# EAGLE design BeeLogic (EAGLE 9.2.1)

## Sheet 1 of 7: uC
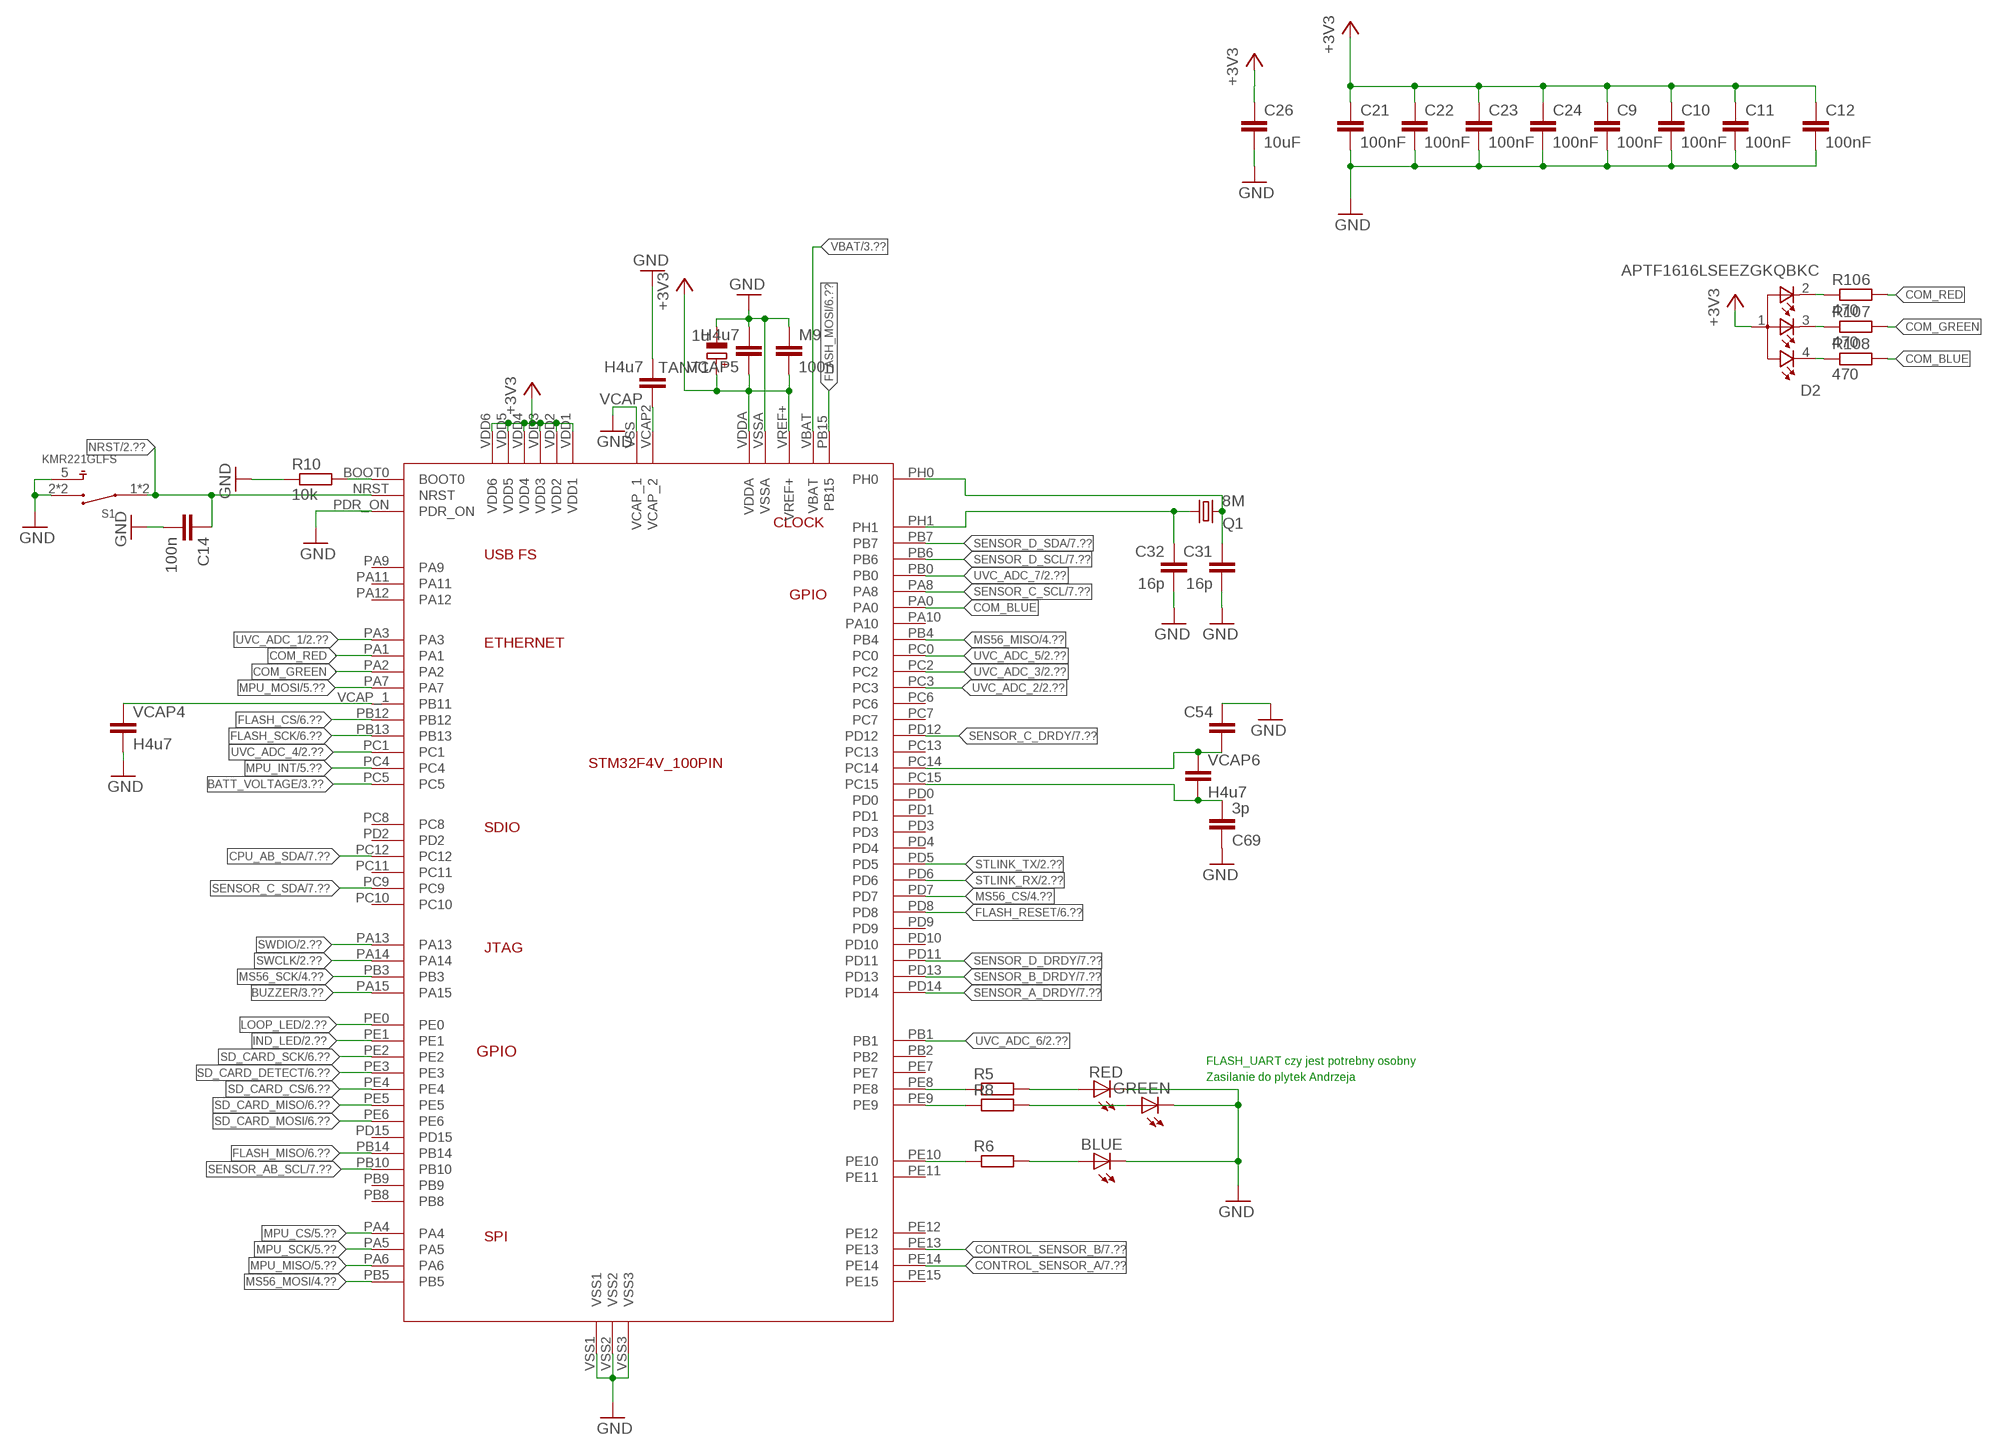
[diagram p0: schematic, sheet 1]

### Parts
BLUE  LEDCHIPLED_0603  [CHIPLED_0603]
C9  100nF  C-EUC0603K  [C0603K]
C10  100nF  C-EUC0603K  [C0603K]
C11  100nF  C-EUC0603K  [C0603K]
C12  100nF  C-EUC0603K  [C0603K]
C14  100n  C-EUC0603K  [C0603K]
C21  100nF  C-EUC0603K  [C0603K]
C22  100nF  C-EUC0603K  [C0603K]
C23  100nF  C-EUC0603K  [C0603K]
C24  100nF  C-EUC0603K  [C0603K]
C26  10uF  C-EUC0805K  [C0805K]
C31  16p  C-EUC0603K  [C0603K]
C32  16p  C-EUC0603K  [C0603K]
C54  3p  C-EUC0603K  [C0603K]
C69  3p  C-EUC0603K  [C0603K]
D2  APTF1616LSEEZGKQBKC  [LEDSC160X160X070-4N]
GREEN  LEDCHIPLED_0603  [CHIPLED_0603]
M9  100n  C-EUC0603K  [C0603K]
Q1  8M  CRYSTALCTS406  [CTS406]
R5  R-EU_R0603  [R0603]
R6  R-EU_R0603  [R0603]
R8  R-EU_R0603  [R0603]
R10  10k  R-EU_R0603  [R0603]
R106  470  R-EU_R0603  [R0603]
R107  470  R-EU_R0603  [R0603]
R108  470  R-EU_R0603  [R0603]
RED  LEDCHIPLED_0603  [CHIPLED_0603]
S1  KMR221GLFS  [SW_KMR221GLFS]
STM32F446VET1  STM32F4V_100PIN_GPSBOARD  [LQFP100]
TANT1  1u  CPOL-EUSMCA  [SMC_A]
VCAP  H4u7  C-EUC0805K  [C0805K]
VCAP4  H4u7  C-EUC0805K  [C0805K]
VCAP5  H4u7  C-EUC0805K  [C0805K]
VCAP6  H4u7  C-EUC0805K  [C0805K]

### Nets
+3V3: C9.1 C10.1 C11.1 C12.1 C21.1 C22.1 C23.1 C24.1 C26.1 D2.1 M9.2 STM32F446VET1.VDD1 STM32F446VET1.VDD2 STM32F446VET1.VDD3 STM32F446VET1.VDD4 STM32F446VET1.VDD5 STM32F446VET1.VDD6 STM32F446VET1.VDDA STM32F446VET1.VREF+ TANT1.+ VCAP5.1 ; also sheet 2,3,4,5,6,7
BATT_VOLTAGE: STM32F446VET1.PC5 ; also sheet 3
BUZZER: STM32F446VET1.PA15 ; also sheet 3
COM_BLUE: R108.2 STM32F446VET1.PA0
COM_GREEN: R107.2 STM32F446VET1.PA2
COM_RED: R106.2 STM32F446VET1.PA1
CONTROL_SENSOR_A: STM32F446VET1.PE14 ; also sheet 7
CONTROL_SENSOR_B: STM32F446VET1.PE13 ; also sheet 7
CPU_AB_SDA: STM32F446VET1.PC12 ; also sheet 7
FLASH_CS: STM32F446VET1.PB12 ; also sheet 6
FLASH_MISO: STM32F446VET1.PB14 ; also sheet 6
FLASH_MOSI: STM32F446VET1.PB15 ; also sheet 6
FLASH_RESET: STM32F446VET1.PD8 ; also sheet 6
FLASH_SCK: STM32F446VET1.PB13 ; also sheet 6
GND: BLUE.C C9.2 C10.2 C11.2 C12.2 C14.2 C21.2 C22.2 C23.2 C24.2 C26.2 C31.2 C32.2 C54.2 C69.1 GREEN.C M9.1 R10.1 RED.C S1.2 S1.3 S1.5 STM32F446VET1.PDR_ON STM32F446VET1.VSS1 STM32F446VET1.VSS2 STM32F446VET1.VSS3 STM32F446VET1.VSS(VCAP_1) STM32F446VET1.VSSA TANT1.- VCAP4.2 VCAP5.2 VCAP.2 ; also sheet 2,3,4,5,6,7
IND_LED: STM32F446VET1.PE1 ; also sheet 2
LOOP_LED: STM32F446VET1.PE0 ; also sheet 2
MPU_CS: STM32F446VET1.PA4 ; also sheet 5
MPU_INT: STM32F446VET1.PC4 ; also sheet 5
MPU_MISO: STM32F446VET1.PA6 ; also sheet 5
MPU_MOSI: STM32F446VET1.PA7 ; also sheet 5
MPU_SCK: STM32F446VET1.PA5 ; also sheet 5
MS56_CS: STM32F446VET1.PD7 ; also sheet 4
MS56_MISO: STM32F446VET1.PB4 ; also sheet 4
MS56_MOSI: STM32F446VET1.PB5 ; also sheet 4
MS56_SCK: STM32F446VET1.PB3 ; also sheet 4
N$6: R5.1 STM32F446VET1.PE8
N$7: R8.1 STM32F446VET1.PE9
N$10: R6.1 STM32F446VET1.PE10
N$11: R10.2 STM32F446VET1.BOOT0
N$12: C31.1 Q1.3 STM32F446VET1.PH0
N$13: C32.1 Q1.1 STM32F446VET1.PH1
N$14: R5.2 RED.A
N$15: GREEN.A R8.2
N$16: BLUE.A R6.2
N$20: STM32F446VET1.VCAP2(VCAP_2) VCAP.1
N$70: STM32F446VET1.VCAP_1(PB11) VCAP4.1
N$102: D2.2 R106.1
N$103: D2.3 R107.1
N$104: D2.4 R108.1
N$108: C54.1 STM32F446VET1.PC14 VCAP6.1
N$109: C69.2 STM32F446VET1.PC15 VCAP6.2
NRST: C14.1 S1.1 S1.4 STM32F446VET1.NRST ; also sheet 2
SD_CARD_CS: STM32F446VET1.PE4 ; also sheet 6
SD_CARD_DETECT: STM32F446VET1.PE3 ; also sheet 6
SD_CARD_MISO: STM32F446VET1.PE5 ; also sheet 6
SD_CARD_MOSI: STM32F446VET1.PE6 ; also sheet 6
SD_CARD_SCK: STM32F446VET1.PE2 ; also sheet 6
SENSOR_A_DRDY: STM32F446VET1.PD14 ; also sheet 7
SENSOR_AB_SCL: STM32F446VET1.PB10 ; also sheet 7
SENSOR_B_DRDY: STM32F446VET1.PD13 ; also sheet 7
SENSOR_C_DRDY: STM32F446VET1.PD12 ; also sheet 7
SENSOR_C_SCL: STM32F446VET1.PA8 ; also sheet 7
SENSOR_C_SDA: STM32F446VET1.PC9 ; also sheet 7
SENSOR_D_DRDY: STM32F446VET1.PD11 ; also sheet 7
SENSOR_D_SCL: STM32F446VET1.PB6 ; also sheet 7
SENSOR_D_SDA: STM32F446VET1.PB7 ; also sheet 7
STLINK_RX: STM32F446VET1.PD6 ; also sheet 2
STLINK_TX: STM32F446VET1.PD5 ; also sheet 2
SWCLK: STM32F446VET1.PA14 ; also sheet 2
SWDIO: STM32F446VET1.PA13 ; also sheet 2
UVC_ADC_1: STM32F446VET1.PA3 ; also sheet 2
UVC_ADC_2: STM32F446VET1.PC3 ; also sheet 2
UVC_ADC_3: STM32F446VET1.PC2 ; also sheet 2
UVC_ADC_4: STM32F446VET1.PC1 ; also sheet 2
UVC_ADC_5: STM32F446VET1.PC0 ; also sheet 2
UVC_ADC_6: STM32F446VET1.PB1 ; also sheet 2
UVC_ADC_7: STM32F446VET1.PB0 ; also sheet 2
VBAT: STM32F446VET1.VBAT ; also sheet 3
Unconnected: STM32F446VET1.PA9 STM32F446VET1.PA10 STM32F446VET1.PA11 STM32F446VET1.PA12 STM32F446VET1.PB2 STM32F446VET1.PB8 STM32F446VET1.PB9 STM32F446VET1.PC6 STM32F446VET1.PC7 STM32F446VET1.PC8 STM32F446VET1.PC10 STM32F446VET1.PC11 STM32F446VET1.PC13 STM32F446VET1.PD0 STM32F446VET1.PD1 STM32F446VET1.PD2 STM32F446VET1.PD3 STM32F446VET1.PD4 STM32F446VET1.PD9 STM32F446VET1.PD10 STM32F446VET1.PD15 STM32F446VET1.PE7 STM32F446VET1.PE11 STM32F446VET1.PE12 STM32F446VET1.PE15

### Notes on the sheet
- FLASH_UART czy jest potrebny osobny
- Zasilanie do plytek Andrzeja

## Sheet 2 of 7: PLUGS
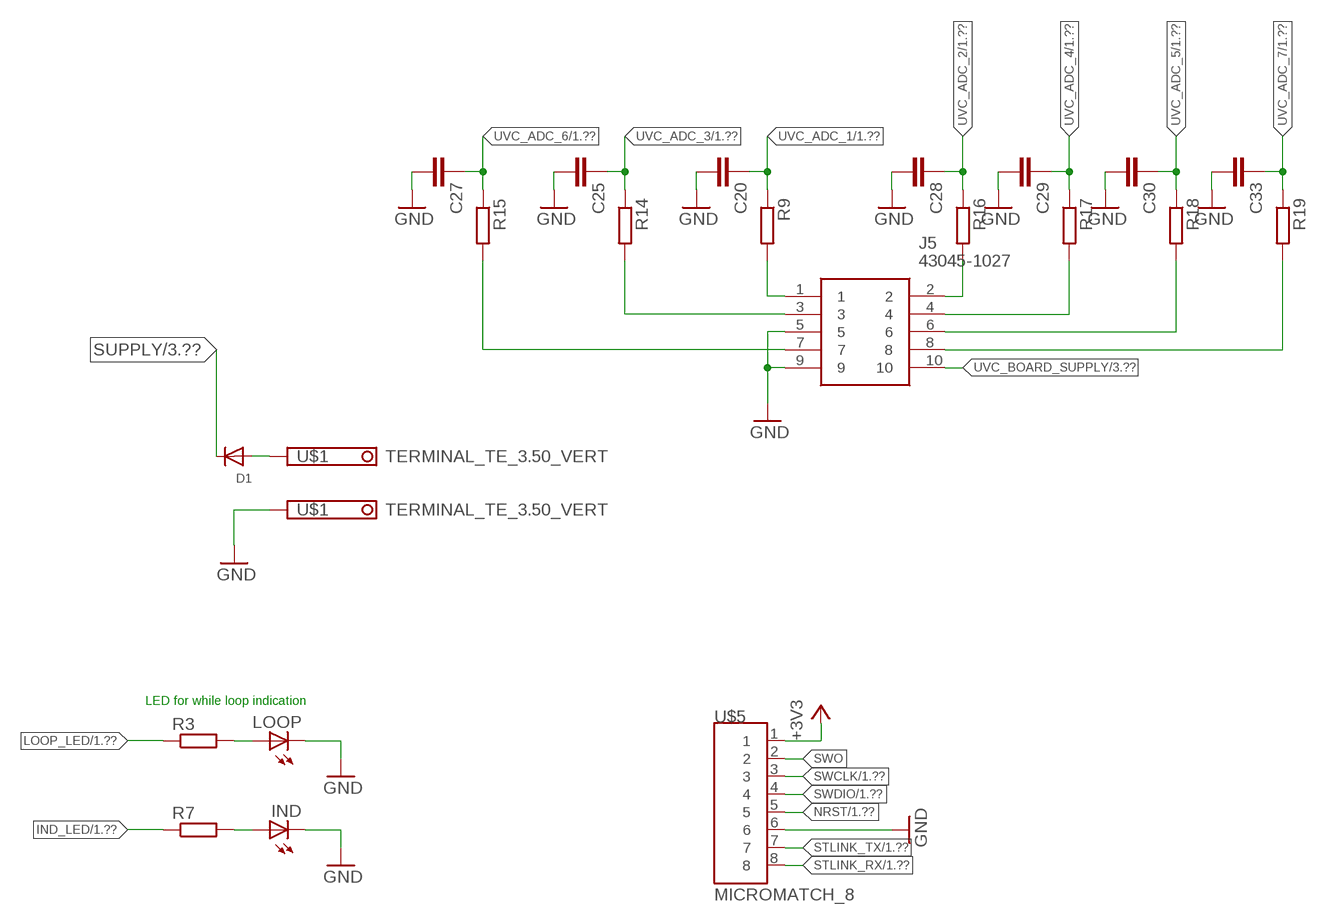
[diagram p1: schematic, sheet 2]

### Parts
C20  C-EUC0603  [C0603]
C25  C-EUC0603  [C0603]
C27  C-EUC0603  [C0603]
C28  C-EUC0603  [C0603]
C29  C-EUC0603  [C0603]
C30  C-EUC0603  [C0603]
C33  C-EUC0603  [C0603]
D1  DIODE_SOD-123FL  [SOD-123FL]
IND  LEDCHIPLED_0603  [CHIPLED_0603]
J5  43045-1027  [43045-1028_1]
LOOP  LEDCHIPLED_0603  [CHIPLED_0603]
R3  R-EU_R0603  [R0603]
R7  R-EU_R0603  [R0603]
R9  R-EU_R0603  [R0603]
R14  R-EU_R0603  [R0603]
R15  R-EU_R0603  [R0603]
R16  R-EU_R0603  [R0603]
R17  R-EU_R0603  [R0603]
R18  R-EU_R0603  [R0603]
R19  R-EU_R0603  [R0603]
U$1  TERMINAL_TE_3.50_VERT  [TE_3.5_TERMINAL_VERT]
U$5  MICROMATCH_8  [MICROMATCH_8]

### Nets
+3V3: U$5.1 ; also sheet 1,3,4,5,6,7
GND: C20.2 C25.2 C27.2 C28.2 C29.2 C30.2 C33.2 IND.C J5.5 J5.9 LOOP.C U$1.P$2(K1) U$5.6 ; also sheet 1,3,4,5,6,7
IND_LED: R7.1 ; also sheet 1
LOOP_LED: R3.1 ; also sheet 1
N$2: LOOP.A R3.2
N$4: D1.A U$1.P$1(K)
N$8: IND.A R7.2
N$17: J5.1 R9.2
N$18: J5.7 R15.2
N$19: J5.3 R14.2
N$25: J5.2 R16.2
N$27: J5.4 R17.2
N$29: J5.6 R18.2
N$34: J5.8 R19.2
NRST: U$5.5 ; also sheet 1
STLINK_RX: U$5.8 ; also sheet 1
STLINK_TX: U$5.7 ; also sheet 1
SUPPLY: D1.C ; also sheet 3
SWCLK: U$5.3 ; also sheet 1
SWDIO: U$5.4 ; also sheet 1
SWO: U$5.2
UVC_ADC_1: C20.1 R9.1 ; also sheet 1
UVC_ADC_2: C28.1 R16.1 ; also sheet 1
UVC_ADC_3: C25.1 R14.1 ; also sheet 1
UVC_ADC_4: C29.1 R17.1 ; also sheet 1
UVC_ADC_5: C30.1 R18.1 ; also sheet 1
UVC_ADC_6: C27.1 R15.1 ; also sheet 1
UVC_ADC_7: C33.1 R19.1 ; also sheet 1
UVC_BOARD_SUPPLY: J5.10 ; also sheet 3

### Notes on the sheet
- LED for while loop indication

## Sheet 3 of 7: SUPPLY
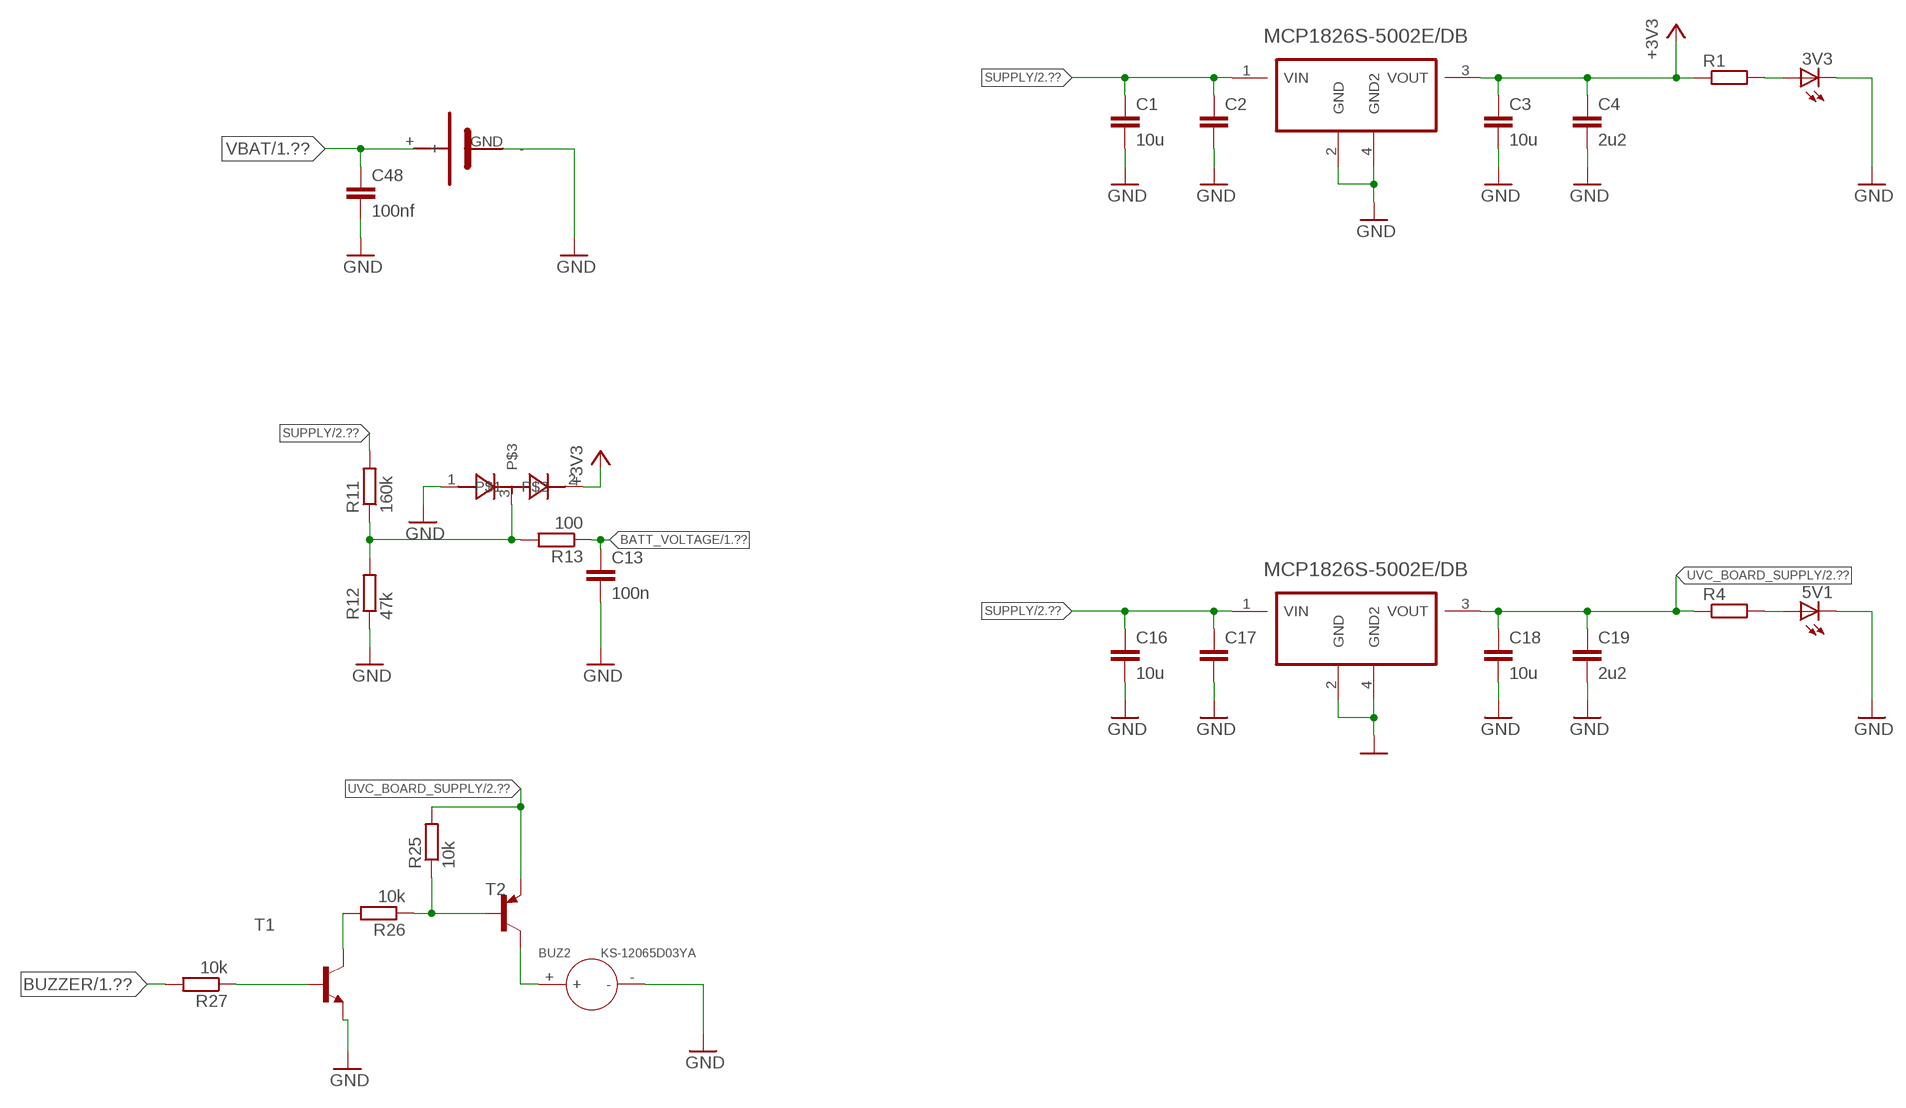
[diagram p2: schematic, sheet 3]

### Parts
3V3  LEDCHIPLED_0603  [CHIPLED_0603]
5V1  LEDCHIPLED_0603  [CHIPLED_0603]
BUZ2  KS-12065D03YA  DIP-BUZZER-3V(KS-12065D03YA)  [BZ2-7.6-D12.0XH6.5MM]
C1  10u  C-EUC0805K  [C0805K]
C2  C-EUC0805K  [C0805K]
C3  10u  C-EUC0805K  [C0805K]
C4  2u2  C-EUC0805K  [C0805K]
C13  100n  C-EUC0603  [C0603]
C16  10u  C-EUC0805K  [C0805K]
C17  C-EUC0805K  [C0805K]
C18  10u  C-EUC0805K  [C0805K]
C19  2u2  C-EUC0805K  [C0805K]
C48  100nf  C-EUC0805K  [C0805K]
R1  R-EU_R0603  [R0603]
R4  R-EU_R0603  [R0603]
R11  160k  R-EU_R0603  [R0603]
R12  47k  R-EU_R0603  [R0603]
R13  100  R-EU_R0603  [R0603]
R25  10k  R-EU_R0603  [R0603]
R26  10k  R-EU_R0603  [R0603]
R27  10k  R-EU_R0603  [R0603]
T1  BCW81-NPN-SOT23-BEC  [SOT23-BEC]
T2  BC807-16-PNP-SOT23-BEC  [SOT23-BEC]
U1  MCP1826S-5002E/DB  [SOT230P700X180-4N]
U3  MCP1826S-5002E/DB  [SOT230P700X180-4N]
U$16  BAS40W-04  [SOT65P210X110-3N]
U$32  CR1220_POZ  [CR1220_POZ]

### Nets
+3V3: C3.1 C4.1 R1.1 U1.3(VOUT) U$16.2 ; also sheet 1,2,4,5,6,7
BATT_VOLTAGE: C13.1 R13.1 ; also sheet 1
BUZZER: R27.2 ; also sheet 1
GND: 3V3.C 5V1.C BUZ2.- C1.2 C2.2 C3.2 C4.2 C13.2 C16.2 C17.2 C18.2 C19.2 C48.2 R12.1 T1.E U1.2(GND) U1.4(GND2) U3.2(GND) U3.4(GND2) U$16.1 U$32.GND(-) ; also sheet 1,2,4,5,6,7
N$1: 3V3.A R1.2
N$5: 5V1.A R4.2
N$9: R11.1 R12.2 R13.2 U$16.3
N$24: R25.1 R26.1 T2.B
N$31: BUZ2.+ T2.C
N$32: R26.2 T1.C
N$33: R27.1 T1.B
SUPPLY: C1.1 C2.1 C16.1 C17.1 R11.2 U1.1(VIN) U3.1(VIN) ; also sheet 2
UVC_BOARD_SUPPLY: C18.1 C19.1 R4.1 R25.2 T2.E U3.3(VOUT) ; also sheet 2
VBAT: C48.1 U$32.+ ; also sheet 1

## Sheet 4 of 7: MS5607
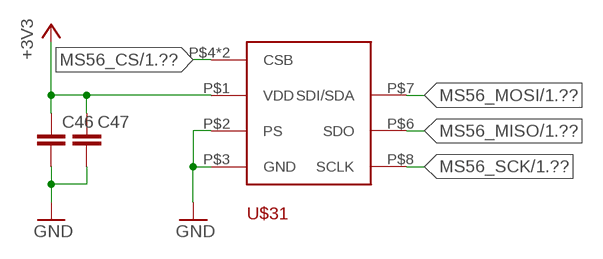
[diagram p3: schematic, sheet 4]

### Parts
C46  C-EUC0603  [C0603]
C47  C-EUC0603  [C0603]
U$31  MS56XX  [MS56XX]

### Nets
+3V3: C46.1 C47.1 U$31.P$1(VDD) ; also sheet 1,2,3,5,6,7
GND: C46.2 C47.2 U$31.P$2(PS) U$31.P$3(GND) ; also sheet 1,2,3,5,6,7
MS56_CS: U$31.P$4(CSB) U$31.P$5(CSB) ; also sheet 1
MS56_MISO: U$31.P$6(SDO) ; also sheet 1
MS56_MOSI: U$31.P$7(SDI/SDA) ; also sheet 1
MS56_SCK: U$31.P$8(SCLK) ; also sheet 1

## Sheet 5 of 7: MPU9250
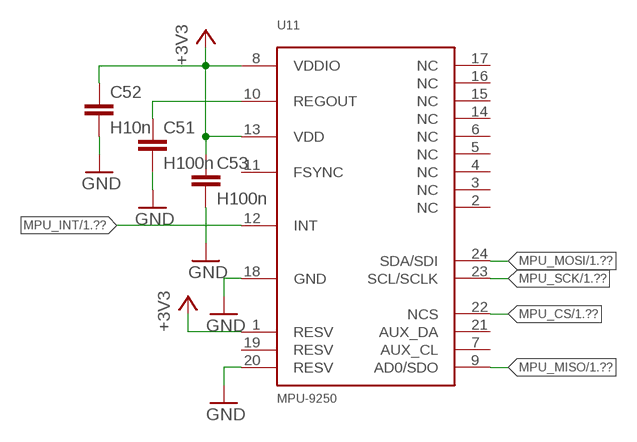
[diagram p4: schematic, sheet 5]

### Parts
C51  H100n  C-EUC0603K  [C0603K]
C52  H10n  C-EUC0603K  [C0603K]
C53  H100n  C-EUC0603K  [C0603K]
U11  MPU-9250  [MPU-9250]

### Nets
+3V3: C52.1 C53.1 U11.1(RESV) U11.8(VDDIO) U11.13(VDD) ; also sheet 1,2,3,4,6,7
GND: C51.2 C52.2 C53.2 U11.18(GND) U11.20(RESV) ; also sheet 1,2,3,4,6,7
MPU_CS: U11.22(NCS) ; also sheet 1
MPU_INT: U11.12(INT) ; also sheet 1
MPU_MISO: U11.9(AD0/SDO) ; also sheet 1
MPU_MOSI: U11.24(SDA/SDI) ; also sheet 1
MPU_SCK: U11.23(SCL/SCLK) ; also sheet 1
N$35: C51.1 U11.10(REGOUT)
Unconnected: U11.2(NC) U11.3(NC) U11.4(NC) U11.5(NC) U11.6(NC) U11.7(AUX_CL) U11.11(FSYNC) U11.14(NC) U11.15(NC) U11.16(NC) U11.17(NC) U11.19(RESV) U11.21(AUX_DA)

## Sheet 6 of 7: SAVE DATA
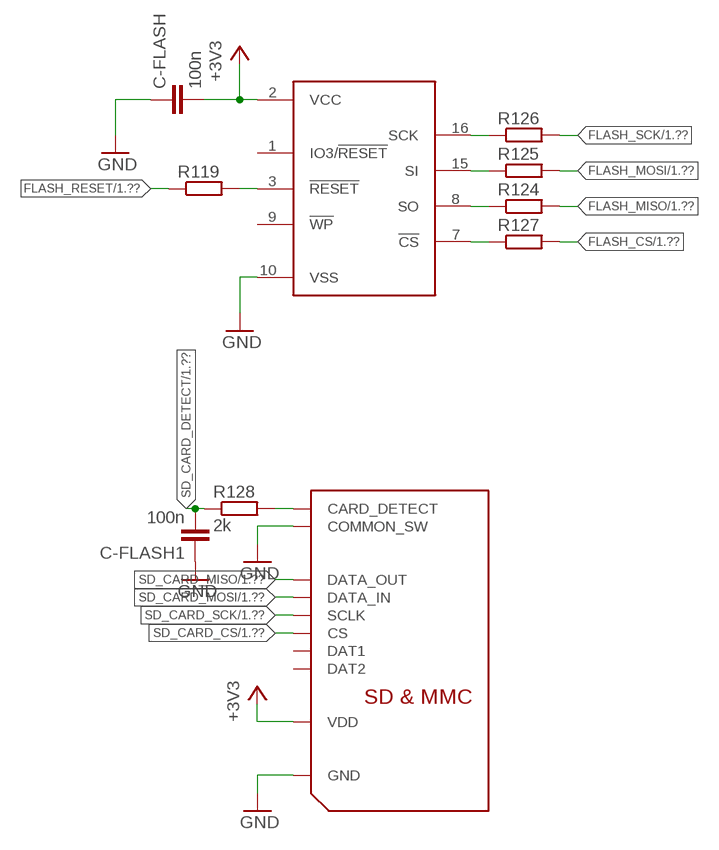
[diagram p5: schematic, sheet 6]

### Parts
C-FLASH  100n  C-EUC0603K  [C0603K]
C-FLASH1  100n  C-EUC0603K  [C0603K]
R119  R-EU_R0603  [R0603]
R124  R-EU_R0603  [R0603]
R125  R-EU_R0603  [R0603]
R126  R-EU_R0603  [R0603]
R127  R-EU_R0603  [R0603]
R128  2k  R-EU_R0603  [R0603]
U$2  S25FLX  [SOIC16]
U$4  MOLEX_MICRO_SD_503182-1853  [MOLEX_MICRO_SD_503182-1853]

### Nets
+3V3: C-FLASH.2 U$2.2(VCC) U$4.PIN4(VDD) ; also sheet 1,2,3,4,5,7
FLASH_CS: R127.2 ; also sheet 1
FLASH_MISO: R124.2 ; also sheet 1
FLASH_MOSI: R125.2 ; also sheet 1
FLASH_RESET: R119.1 ; also sheet 1
FLASH_SCK: R126.2 ; also sheet 1
GND: C-FLASH1.1 C-FLASH.1 U$2.10(VSS) U$4.DETECT_GND(COMMON_SW) U$4.PIN6(GND) ; also sheet 1,2,3,4,5,7
N$161: R126.1 U$2.16(SCK)
N$162: R125.1 U$2.15(SI)
N$163: R124.1 U$2.8(SO)
N$164: R127.1 U$2.7(!CS)
N$165: R119.2 U$2.3(!RESET)
N$166: R128.2 U$4.DETECT(CARD_DETECT)
SD_CARD_CS: U$4.PIN2(CS) ; also sheet 1
SD_CARD_DETECT: C-FLASH1.2 R128.1 ; also sheet 1
SD_CARD_MISO: U$4.PIN7(DATA_OUT) ; also sheet 1
SD_CARD_MOSI: U$4.PIN3(DATA_IN) ; also sheet 1
SD_CARD_SCK: U$4.PIN5(SCLK) ; also sheet 1
Unconnected: U$2.1(IO3/!RESET) U$2.9(!WP) U$4.PIN1(DAT2) U$4.PIN8(DAT1)

## Sheet 7 of 7: Sensors
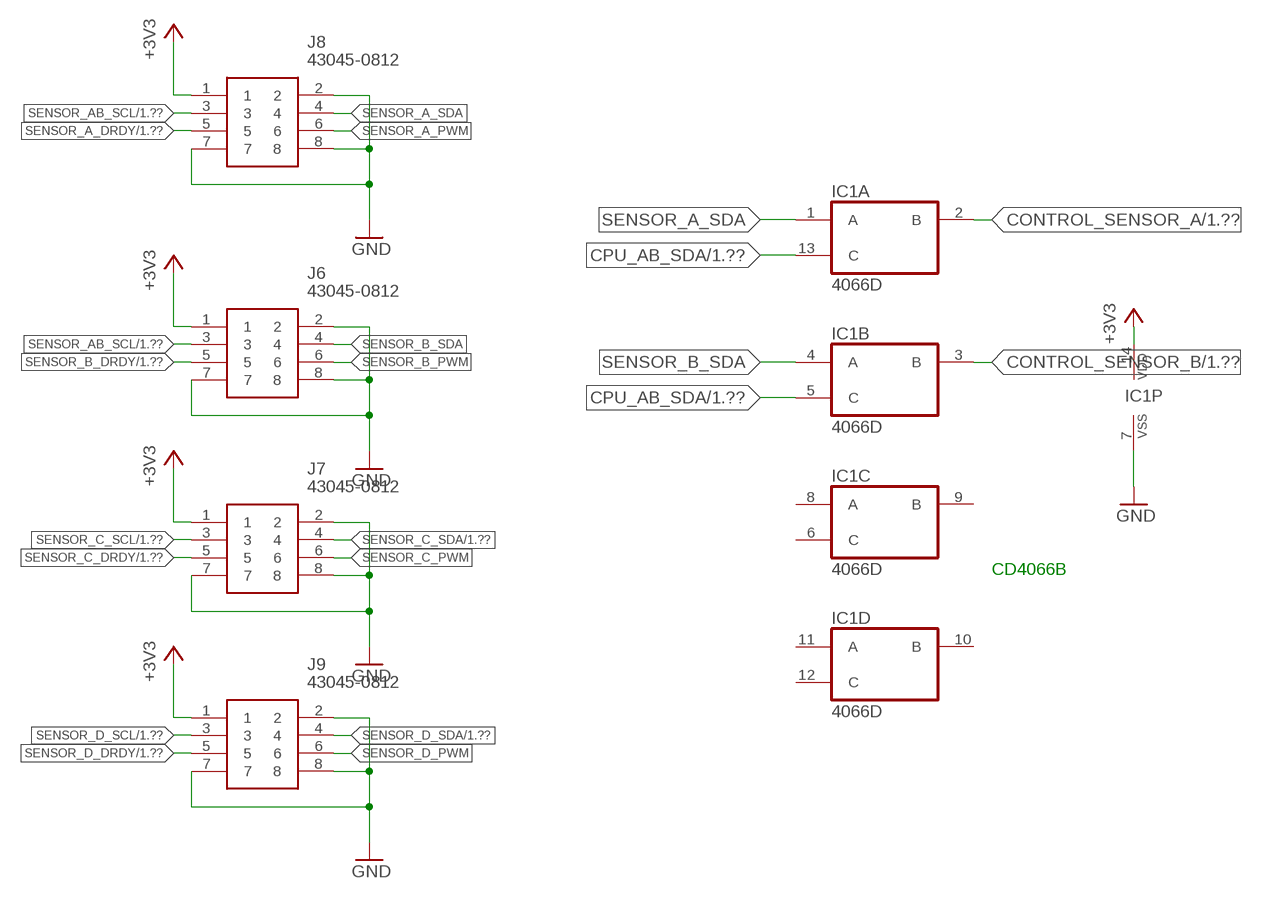
[diagram p6: schematic, sheet 7]

### Parts
IC1  4066D  [SO14]
J6  43045-0812  [430450812]
J7  43045-0812  [430450812]
J8  43045-0812  [430450812]
J9  43045-0812  [430450812]

### Nets
+3V3: IC1.14(P:VDD) J6.1 J7.1 J8.1 J9.1 ; also sheet 1,2,3,4,5,6
CONTROL_SENSOR_A: IC1.2(A:B) ; also sheet 1
CONTROL_SENSOR_B: IC1.3(B:B) ; also sheet 1
CPU_AB_SDA: IC1.5(B:C) IC1.13(A:C) ; also sheet 1
GND: IC1.7(P:VSS) J6.2 J6.7 J6.8 J7.2 J7.7 J7.8 J8.2 J8.7 J8.8 J9.2 J9.7 J9.8 ; also sheet 1,2,3,4,5,6
SENSOR_A_DRDY: J8.5 ; also sheet 1
SENSOR_A_PWM: J8.6
SENSOR_A_SDA: IC1.1(A:A) J8.4
SENSOR_AB_SCL: J6.3 J8.3 ; also sheet 1
SENSOR_B_DRDY: J6.5 ; also sheet 1
SENSOR_B_PWM: J6.6
SENSOR_B_SDA: IC1.4(B:A) J6.4
SENSOR_C_DRDY: J7.5 ; also sheet 1
SENSOR_C_PWM: J7.6
SENSOR_C_SCL: J7.3 ; also sheet 1
SENSOR_C_SDA: J7.4 ; also sheet 1
SENSOR_D_DRDY: J9.5 ; also sheet 1
SENSOR_D_PWM: J9.6
SENSOR_D_SCL: J9.3 ; also sheet 1
SENSOR_D_SDA: J9.4 ; also sheet 1
Unconnected: IC1.6(C:C) IC1.8(C:A) IC1.9(C:B) IC1.10(D:B) IC1.11(D:A) IC1.12(D:C)

### Notes on the sheet
- CD4066B

## Library data of the parts
3V3 5V1 BLUE GREEN IND LOOP RED = adafruit:LED: LED OSRAM: - CHIPLED LG R971, LG N971, LY N971, LG Q971, LY Q971, LO R971, LY R971 LH N974, LH R974 LS Q976, LO Q976, LY Q976 LO Q996 - Hyper CHIPLED LW Q18S LB Q993, LB Q99A, LB R99A - SideLED LS A670, LO A670, LY A670, LG A670, LP A670 LB A673, LV A673, LT A673, LW A673 LH A674 LY A675 LS A676, LA A676, LO A676, LY A676, LW A676 LS A679, LY A679, LG A679 - Hyper Micro SIDELED® LS Y876, LA Y876, LO Y876, LY Y876 LT Y87S - SmartLED LW L88C, LW L88S LB L89C, LB L89S, LG L890 LS L89K, LO L89K, LY L89K LS L896, LA L896, LO L896, LY L896 - TOPLED LS T670, LO T670, LY T670, LG T670, LP T670 LSG T670, LSP T670, LSY T670, LOP T670, LYG T670 LG T671, LOG T671, LSG T671 LB T673, LV T673, LT T673, LW T673 LH T674 LS T676, LA T676, LO T676, LY T676, LB T676, LH T676, LSB T676, LW T676 LB T67C, LV T67C, LT T67C, LS T67K, LO T67K, LY T67K, LW E67C LS E67B, LA E67B, LO E67B, LY E67B, LB E67C, LV E67C, LT E67C LW T67C LS T679, LY T679, LG T679 LS T770, LO T770, LY T770, LG T770, LP T770 LB T773, LV T773, LT T773, LW T773 LH T774 LS E675, LA E675, LY E675, LS T675 LS T776, LA T776, LO T776, LY T776, LB T776 LHGB T686 LT T68C, LB T68C - Hyper Mini TOPLED® LB M676 - Mini TOPLED Santana® LG M470 LS M47K, LO M47K, LY M47K Source: http://www.osram.convergy.de/
BUZ2 = Seeed-Connector:DIP-BUZZER-3V(KS-12065D03YA): 312010004; MPN: KS-12065D03YA
C1-C4 C9-C12 C14 C16-C19 C21-C24 C26 C31 C32 C46-C48 C51-C54 C69 C-FLASH C-FLASH1 M9 VCAP VCAP4-VCAP6 = rcl:C-EU: CAPACITOR, European symbol; SPICEPREFIX: C
C13 = rcl:C-EU: CAPACITOR, European symbol
C20 C25 C27-C30 C33 = resistor:C-EU: CAPACITOR, European symbol
D1 = adafruit:DIODE: Diode SMADIODE - SMA Surface Mount Package 20V 1A Schottky Diode Digikey: 641-1014-6-ND DO-1N4148 - Through Hole Small Current Diode SOD-123 20V 1 A (.5mV Vf) Schottky Diode - Digikey: MBRX120TPMSCT-ND SOD-323 10V 570mA (.38mV Vf, 3ns) Schottky Diode - Digikey: ZLLS410CT-ND SOD-523 30V 30mA Schottky Diode (RB751S-40TE61) - Digikey: RB751S-40TE61CT-ND SOT23-R/W - SOT23 Package (R = Solder Paste/Reflow Ovens, W = Hand-Soldering) BAT54Film 40V 300mA - Digikey: 497-7162-1-ND
D2 = KINGBRIGHT1616:APTF1616LSEEZGKQBKC: HELI Colour; 1.6X1.6MM LOW CURRENT RGB SMD LED; AVAILABILITY: Unavailable; DESCRIPTION: LED RGB 621NM 525NM 465NM 0606; MF: Kingbright; MP: APTF1616LSEEZGKQBKC; PACKAGE: 0606 Kingbright; PRICE: 0.47 USD
IC1 = 40xx:4066: Quad bilateral ANALOG SWITCH
J5 = 43045-1027:43045-1027: Molex MICRO-FIT 3.0 Series, Series Number 43045, 3mm Pitch 10 Way 2 Row Straight PCB Header, Solder Termination, 5A Source: Datasheet <https://www.molex.com/pdm_docs/sd/430451027_sd.pdf>; DESCRIPTION: Molex MICRO-FIT 3.0 Series, Series Number 43045, 3mm Pitch 10 Way 2 Row Straight PCB Header, Solder Termination, 5A; HEIGHT: mm; MANUFACTURER_NAME: Molex; MANUFACTURER_PART_NUMBER: 43045-1027; MOUSER_PART_NUMBER: 538-43045-1027; MOUSER_PRICE-STOCK: https://www.mouser.com/Search/Refine.aspx?Keyword=538-43045-1027; RS_PART_NUMBER: 6700469P; RS_PRICE-STOCK: http://uk.rs-online.com/web/p/products/6700469P
J6-J9 = 43045-0812:43045-0812: 8 way 2 row vertical header,3mm pitch Molex MICRO-FIT 3.0 Series, Series Number 43045, 3mm Pitch 8 Way 2 Row Straight PCB Header, Solder Termination, 5A Source: Datasheet <https://componentsearchengine.com/Datasheets/1/43045-0812.pdf>; DESCRIPTION: 8 way 2 row vertical header,3mm pitch Molex MICRO-FIT 3.0 Series, Series Number 43045, 3mm Pitch 8 Way 2 Row Straight PCB Header, Solder Termination, 5A; HEIGHT: mm; MANUFACTURER_NAME: Molex; MANUFACTURER_PART_NUMBER: 43045-0812; MOUSER_PART_NUMBER: 538-43045-0812; MOUSER_PRICE-STOCK: https://www.mouser.com/Search/Refine.aspx?Keyword=538-43045-0812
Q1 = crystal:CRYSTAL: CRYSTAL; OC_FARNELL: unknown; OC_NEWARK: unknown
R1 R3-R8 R10-R13 R25-R27 R106-R108 R119 R124-R128 = rcl:R-EU_: RESISTOR, European symbol; SPICEPREFIX: R
R9 R14-R19 = resistor:R-EU_: RESISTOR, European symbol
S1 = KMR221GLFS:KMR221GLFS: Switch Tactile N.O. SPST Button Gull Wing 0.05A 32VDC 1VA 200000Cycles 2N SMD Automotive T/R; AVAILABILITY: Good; DESCRIPTION: Switch Tactile N.O. SPST Button Gull Wing 0.05A 32VDC 1VA 200000Cycles 2N SMD Automotive T/R; MF: C&K Components; MP: KMR221GLFS; PACKAGE: None; PRICE: 0.28 USD
STM32F446VET1 = stm32f4:STM32F4V_100PIN_GPSBOARD: Custom symbol of 100-pin STM32F407 for GPS RF front-end board. Standard LQFP100 package.
T1 = DC_LOAD_AU:*-NPN-: NPN Transistror BF959 corrected 2008.03.06
T2 = DC_LOAD_AU:*-PNP-: PNP Transistror
TANT1 = rcl:CPOL-EU: POLARIZED CAPACITOR, European symbol
U1 U3 = MCP1826S-5002E_DB:MCP1826S-5002E/DB: IC, LDO, 5V, 1A; AVAILABILITY: Unavailable; DESCRIPTION: MCP1826S Series 1 A 5 V Fixed Output Surface Mount LDO Regulator - SOT-223; MF: Microchip; MP: MCP1826S-5002E/DB; PACKAGE: SOT-223-3 Microchip; PRICE: None
U11 = MPU-9250:MPU-9250: 314990005; AVAILABILITY: Good; DESCRIPTION: SMD Gyroscope/Accelerometer/Magnetometer Sensor; 9-AXIS; MF: InvenSense; MP: MPU-9250; PACKAGE: QFN-24 InvenSense; PRICE: 6.45 USD
U$1 = Terminal_TE_3.50:TERMINAL_TE_3.50_VERT
U$2 = s25FL:S25FLX
U$4 = SD_Reader:MOLEX_MICRO_SD_503182-1853; SPICEPREFIX: X
U$5 = Micromatch:MICROMATCH_8
U$16 = BAS40w-0:BAS40W-04
U$31 = MS56XX:MS56XX
U$32 = SS_coin:CR1220_POZ

## Board
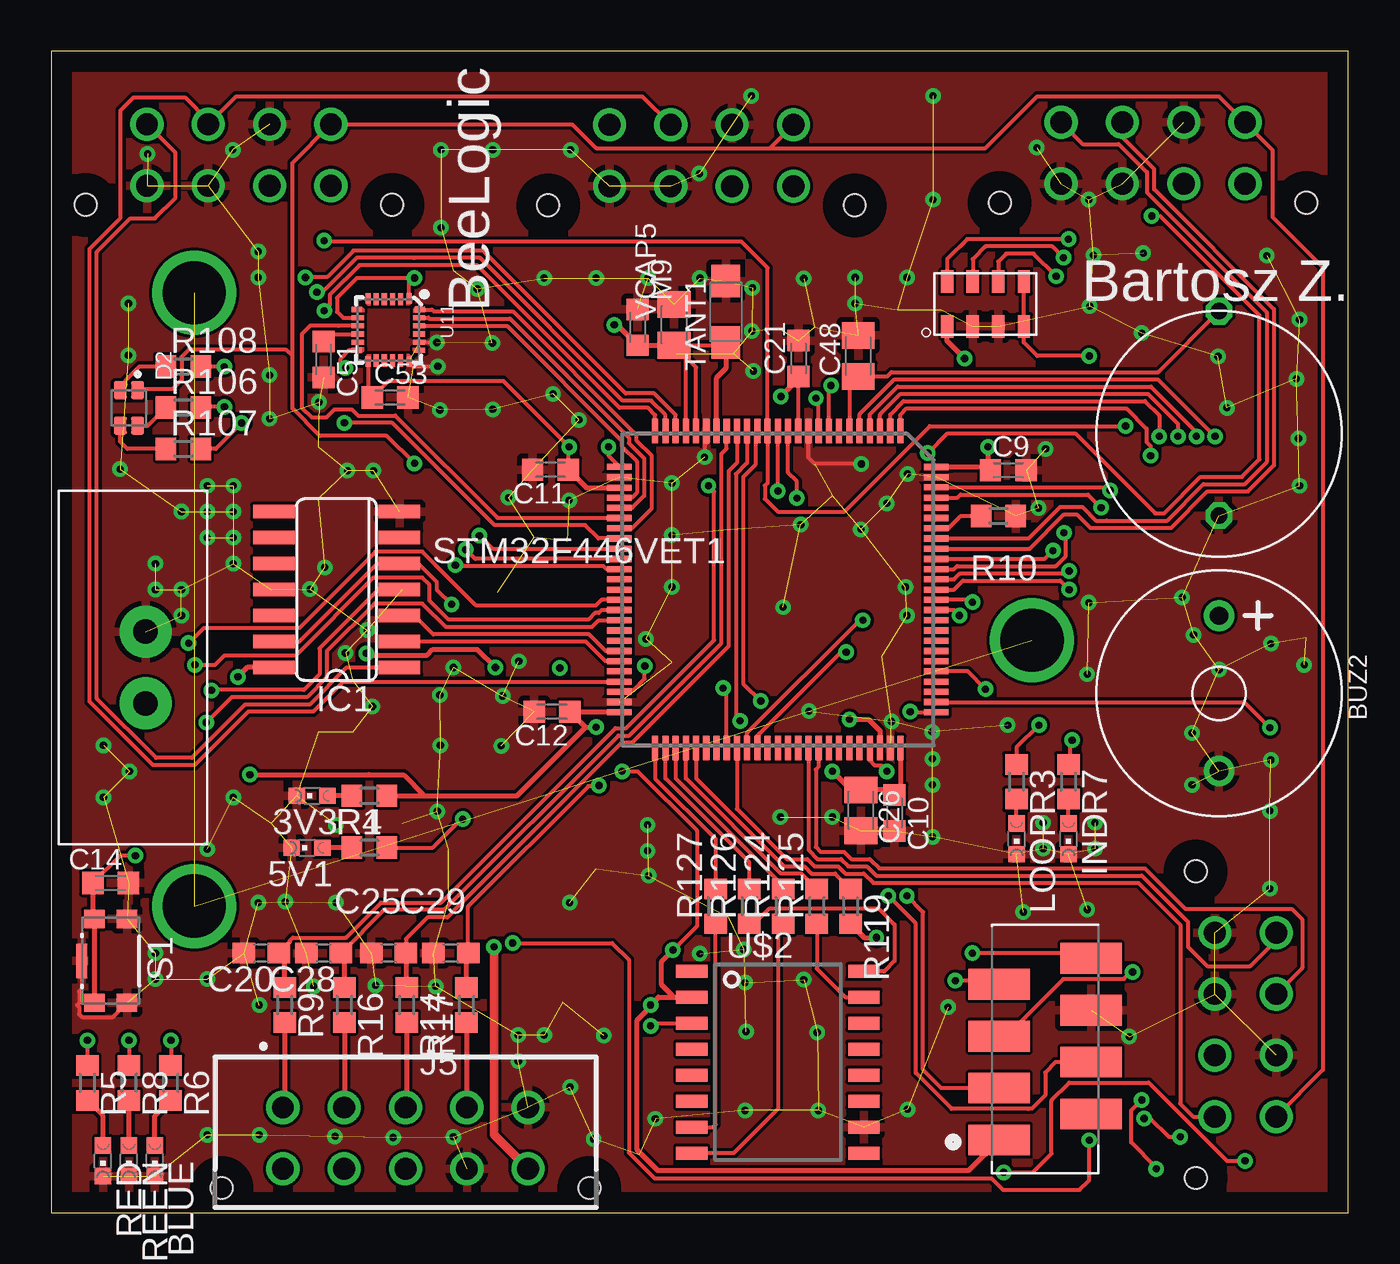
[diagram p7: board, top side]
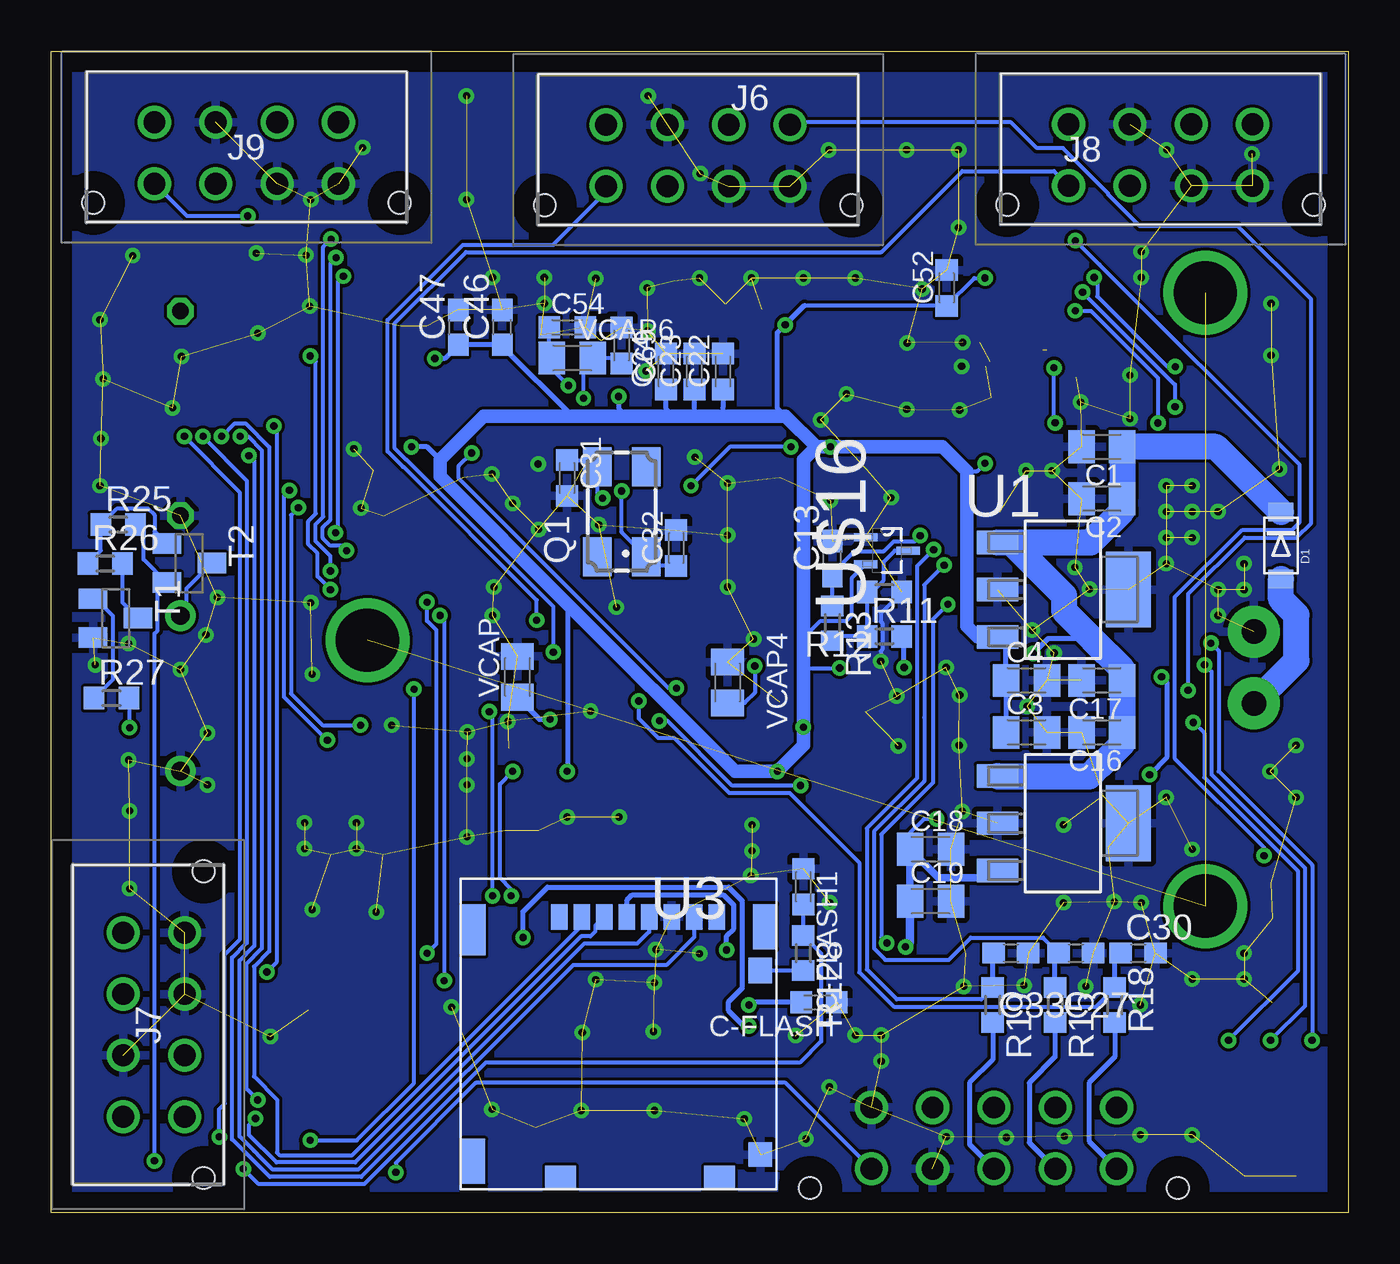
[diagram p8: board, bottom side, seen from below]

Size 63.48 x 56.82 mm. Coordinates in mm from the lower left corner, seen from the top.
Outline: 0,0 63.48,0 63.48,56.82 0,56.82 0,0
Copper layers (1*16): Top 0.035mm / dielectric 1.5mm / Bottom 0.035mm
Design rules "default": minimum track width 6mil, minimum drill 0.35mm, track to track 6mil, track to pad 6mil, pad to pad 6mil, via to via 6mil, smd to smd 6mil, copper to edge 40mil, drill to drill 6mil, minimum pad ring 10mil, minimum via ring 8mil, stop-mask expansion 4mil, vias tented up to drill 0mil, thermal gap 10mil

### Footprints (pad centres in the part's own frame; a part is rotated, then mirrored left to right if it is on the bottom)
CHIPLED_0603 = smd 0.8 x 0.8: A 0,-0.75; C 0,0.75
BZ2-7.6-D12.0XH6.5MM = drill 0.9 pad 1.5: + -3.8,0; - 3.8,0
C0805K = smd 1.3 x 1.6: 1 -1,0; 2 1,0
C0603K = smd 1.05 x 1.08: 1 -0.875,0; 2 0.875,0
C0603 = smd 1.1 x 1: 1 -0.85,0; 2 0.85,0
SOD-123FL = smd 0.91 x 1.22: A 1.637,0; C -1.637,0
LEDSC160X160X070-4N = smd 0.89 x 0.64: 1 -0.87,0.425; 2 0.87,0.425; 3 0.87,-0.425; 4 -0.87,-0.425
SO14 = smd 0.66 x 2.032: 1 -3.81,-3.073; 2 -2.54,-3.073; 3 -1.27,-3.073; 4 0,-3.073; 5 1.27,-3.073; 6 2.54,-3.073; 7 3.81,-3.073; 8 3.81,3.073; 9 2.54,3.073; 10 1.27,3.073; 11 0,3.073; 12 -1.27,3.073; 13 -2.54,3.073; 14 -3.81,3.073
43045-1028_1 = drill 1.07 pad 1.62: 1 15.325,2.47; 2 12.325,2.47; 3 9.325,2.47; 4 6.325,2.47; 5 3.325,2.47; 6 15.325,5.47; 7 12.325,5.47; 8 9.325,5.47; 9 6.325,5.47; 10 3.325,5.47 | hole 1.07: 0.325,6.41; 18.325,6.41
430450812 = drill 1.07 pad 1.62: 1 0,0; 2 -3,0; 3 -6,0; 4 -9,0; 5 0,3; 6 -3,3; 7 -6,3; 8 -9,3 | hole 1.07: -12,3.94; 3,3.94
CTS406 = smd 1.9 x 1.4: 1 -2.2,-1.2; 2 2.2,-1.2; 3 2.2,1.2; 4 -2.2,1.2
R0603 = smd 1 x 1.1: 1 -0.85,0; 2 0.85,0
SW_KMR221GLFS = smd 0.9 x 1: 1 -2.05,0.8; 2 -2.05,-0.8; 3 2.05,-0.8; 4 2.05,0.8 | smd 1.7 x 0.55: 5 0,1.425
LQFP100 = smd 1.2 x 0.3: BOOT0 -7.75,-3; PA3 7.75,-6.016; PA4 7.75,-4.5; PA5 7.75,-4; PA6 7.75,-3.5; PA7 7.75,-3; PA14 -7.75,6; PA15 -7.75,5.5; PB0 7.75,-1.5; PB1 7.75,-1; PB2 7.75,-0.5; PB3 -7.75,-0.5; PB4 -7.75,-1; PB5 -7.75,-1.5; PB6 -7.75,-2; PB7 -7.75,-2.5; PB8 -7.75,-3.5; PB9 -7.75,-4; PB10 7.75,4.5; PC4 7.75,-2.5; PC5 7.75,-2; PC10 -7.75,5; PC11 -7.75,4.5; PC12 -7.75,4; PD0 -7.75,3.5; PD1 -7.75,3; PD2 -7.75,2.5; PD3 -7.75,2; PD4 -7.75,1.5; PD5 -7.75,1; PD6 -7.75,0.5; PD7 -7.75,0; PDR_ON -7.75,-5.5; PE0 -7.75,-4.5; PE1 -7.75,-5; PE7 7.75,0; PE8 7.75,0.5; PE9 7.75,1; PE10 7.75,1.5; PE11 7.75,2; PE12 7.75,2.5; PE13 7.75,3; PE14 7.75,3.5; PE15 7.75,4; VCAP_1 7.75,5; VDD3 7.75,-4.984; VDD4 7.75,6; VDD6 -7.75,-6; VSS 7.75,5.5; VSS2 7.75,-5.5 | smd 0.3 x 1.2: NRST 0.5,-7.75; PA0 5,-7.75; PA1 5.5,-7.75; PA2 6,-7.75; PA8 -2,7.75; PA9 -2.5,7.75; PA10 -3,7.75; PA11 -3.5,7.75; PA12 -4,7.75; PA13 -4.5,7.75; PB12 6,7.75; PB13 5.5,7.75; PB14 5,7.75; PB15 4.5,7.75; PC0 1,-7.75; PC1 1.5,-7.75; PC2 2,-7.75; PC3 2.5,-7.75; PC6 0,7.75; PC7 -0.5,7.75; PC8 -1,7.75; PC9 -1.5,7.75; PC13 -3,-7.75; PC14 -2.5,-7.75; PC15 -2,-7.75; PD8 4,7.75; PD9 3.5,7.75; PD10 3,7.75; PD11 2.5,7.75; PD12 2,7.75; PD13 1.5,7.75; PD14 1,7.75; PD15 0.5,7.75; PE2 -6,-7.75; PE3 -5.5,-7.75; PE4 -5,-7.75; PE5 -4.5,-7.75; PE6 -4,-7.75; PH0 -0.5,-7.75; PH1 0,-7.75; VBAT -3.5,-7.75; VCAP2 -5,7.75; VDD1 -1,-7.75; VDD2 3,-7.75; VDD5 -6,7.75; VDDA 4.5,-7.75; VREF+ 4,-7.75; VSS1 -1.5,-7.75; VSS3 -5.5,7.75; VSSA 3.5,-7.75
SOT23-BEC = smd 1 x 1.4: B -0.95,-1.1; C 0,1.1; E 0.95,-1.1
SMC_A = smd 1.6 x 1.4: + -1.5,0; - 1.5,0
SOT230P700X180-4N = smd 2.032 x 1.143: 1 -3.2,2.311; 2 -3.2,0; 3 -3.2,-2.311 | smd 2.2 x 3.7: 4 3.2,0
MPU-9250 = smd 0.495 x 0.25: 1 -1.552,1; 6 -1.552,-1; 13 1.552,-1; 18 1.552,1 | smd 0.6 x 0.25: 2 -1.5,0.6; 3 -1.5,0.2; 4 -1.5,-0.2; 5 -1.5,-0.6; 14 1.5,-0.6; 15 1.5,-0.2; 16 1.5,0.2; 17 1.5,0.6 | smd 0.25 x 0.495: 7 -1,-1.552; 12 1,-1.552; 19 1,1.552; 24 -1,1.552 | smd 0.25 x 0.6: 8 -0.6,-1.5; 9 -0.2,-1.5; 10 0.2,-1.5; 11 0.6,-1.5; 20 0.6,1.5; 21 0.2,1.5; 22 -0.2,1.5; 23 -0.6,1.5
TE_3.5_TERMINAL_VERT = drill 1.2 pad 2.54: P$1 1.75,-3; P$2 -1.75,-3
SOIC16 = smd 0.635 x 1.524: 1 -4.445,-4.215; 2 -3.175,-4.215; 3 -1.905,-4.215; 4 -0.635,-4.215; 5 0.635,-4.215; 6 1.905,-4.215; 7 3.175,-4.215; 8 4.445,-4.215; 9 4.445,4.215; 10 3.175,4.215; 11 1.905,4.215; 12 0.635,4.215; 13 -0.635,4.215; 14 -1.905,4.215; 15 -3.175,4.215; 16 -4.445,4.215
MOLEX_MICRO_SD_503182-1853 = smd 1.16 x 1.25: DETECT 14.66,10.7 | smd 1.16 x 1.2: DETECT_GND 14.66,1.7 | smd 1.15 x 2.5: P$9 0.635,12.7 | smd 1.15 x 2.2: P$10 0.625,1.37 | smd 1.5 x 1.15: P$11 4.88,0.575; P$12 12.66,0.575 | smd 1.12 x 2.2: P$15 14.865,12.85 | smd 0.8 x 1.24: PIN1 4.82,13.33; PIN2 5.92,13.33; PIN3 7.02,13.33; PIN4 8.12,13.33; PIN5 9.22,13.33; PIN6 10.32,13.33; PIN7 11.42,13.33; PIN8 12.52,13.33
MICROMATCH_8 = smd 1.5 x 3: 1 -5.715,2.25; 2 -4.445,-2.25; 3 -3.175,2.25; 4 -1.905,-2.25; 5 -0.635,2.25; 6 0.635,-2.25; 7 1.905,2.25; 8 3.175,-2.25
SOT65P210X110-3N = smd 1.168 x 0.406: 1 -1.041,0.66; 2 -1.041,-0.66; 3 1.041,0
MS56XX = smd 1.1 x 0.6: P$1 -1.1,1.875; P$2 -1.1,0.625; P$3 -1.1,-0.625; P$4 -1.1,-1.875; P$5 1.1,-1.875; P$6 1.1,-0.625; P$7 1.1,0.625; P$8 1.1,1.875
CR1220_POZ = drill 0.8 octagon: + 6,0; GND -4,0

### Placement (x,y rotation side)
3V3  12.78,20.4 90 top
5V1  12.52,17.86 90 top
BLUE  5.08,2.54 180 top
BUZ2  57.15,25.4 270 top
C1  12.06,37.47 180 bottom
C2  12.06,34.92 180 bottom
C3  15.75,23.5 0 bottom
C4  15.75,26.04 0 bottom
C9  46.84,36.32 0 top
C10  41.27,19.56 270 top
C11  24.43,36.35 180 top
C12  24.51,24.51 180 top
C13  25.25,32 90 bottom
C14  2.92,16.13 0 top
C16  12.06,23.5 180 bottom
C17  12.06,26.04 180 bottom
C18  20.45,17.78 0 bottom
C19  20.45,15.24 0 bottom
C20  10.29,12.7 180 top
C21  36.58,41.78 90 top
C22  30.61,41.15 90 bottom
C23  32,41.15 90 bottom
C24  33.4,41.15 90 bottom
C25  16.51,12.7 180 top
C26  39.62,19.68 270 top
C27  13.34,12.7 0 bottom
C28  13.34,12.7 180 top
C29  19.56,12.7 180 top
C30  10.29,12.7 0 bottom
C31  38.23,35.94 270 bottom
C32  32.89,32.51 90 bottom
C33  16.51,12.7 0 bottom
C46  41.4,43.31 90 bottom
C47  43.56,43.31 90 bottom
C48  39.5,41.91 90 top
C51  13.34,41.73 270 top
C52  19.66,45.24 90 bottom
C53  16.59,39.88 0 top
C54  38.23,43.31 0 bottom
C69  35.56,42.42 270 bottom
C-FLASH  25.91,10.29 180 bottom
C-FLASH1  26.67,15.95 270 bottom
D1  3.3,32.64 270 bottom
D2  3.81,39.37 270 top
GREEN  3.81,2.54 180 top
IC1  13.97,30.48 90 top
IND  49.78,18.29 180 top
J5  26.67,7.62 180 top
J6  36.32,53.21 180 bottom
J7  59.94,4.7 270 bottom
J8  13.69,53.24 180 bottom
J9  58.42,53.34 180 bottom
LOOP  47.24,18.29 180 top
M9  28.7,43.31 270 top
Q1  35.56,34.29 90 bottom
R1  15.57,20.4 180 top
R3  47.24,21.08 270 top
R4  15.57,17.86 180 top
R5  1.78,6.35 270 top
R6  5.84,6.35 270 top
R7  49.78,21.08 270 top
R8  3.81,6.35 270 top
R9  11.43,10.16 270 top
R10  46.35,34.09 180 top
R11  22.71,28.19 0 bottom
R12  22.71,30.35 180 bottom
R13  25.25,28.83 270 bottom
R14  17.4,10.16 270 top
R15  14.35,10.16 270 bottom
R16  14.35,10.16 270 top
R17  20.32,10.16 270 top
R18  11.43,10.16 270 bottom
R19  17.4,10.16 270 bottom
R25  60.2,33.66 0 bottom
R26  60.83,31.75 0 bottom
R27  60.53,25.17 0 bottom
R106  6.48,39.4 0 top
R107  6.48,37.36 0 top
R108  6.48,41.4 0 top
R119  39.12,14.99 270 top
R124  35.81,14.99 90 top
R125  37.47,14.99 90 top
R126  34.16,14.99 90 top
R127  32.51,14.99 90 top
R128  26.67,12.7 270 bottom
RED  2.54,2.54 180 top
S1  2.92,12.32 90 top
STM32F446VET1  35.56,30.48 180 top
T1  60.33,29.08 270 bottom
T2  56.72,31.78 270 bottom
TANT1  33.02,44.07 90 top
U1  13.97,30.48 0 bottom
U3  13.97,19.05 0 bottom
U11  16.51,43.18 270 top
U$1  7.62,26.67 270 top
U$2  35.56,7.37 270 top
U$4  43.43,1.14 0 bottom
U$5  48.64,9.27 90 top
U$16  22.58,32.38 0 bottom
U$31  45.72,44.45 90 top
U$32  57.15,38.1 90 top
VCAP  40.67,26.21 90 bottom
VCAP4  30.38,25.93 90 bottom
VCAP5  30.48,43.43 90 top
VCAP6  37.97,41.81 0 bottom

### Tracks (layer width: path | path; a pad name or v marks a point on that pad's centre or on a via)
+3V3  (via drill 0.35)
  Top 0.203: C21.1 36.56,40.89 STM32F446VET1.VDD1 | U11.8 14.28,43.78 13.99,44.07 13.99,44.76 14.96,45.72 v17.78,45.72 17.51,45.45 U11.1 | v17.78,36.65 16.43,38 13.15,38 11.81,39.34 11.81,41.91 | D2.1 4.28,40.28 5.92,40.28 6.38,40.75 6.38,41.87 6.72,42.21 11.51,42.21 11.81,41.91 | 11.81,41.91 11.81,51.36 J8.1 25.5,53.24 26.67,52.07 35.18,52.07 | 35.18,52.07 J6.1 | 35.18,52.07 45.72,52.07 48.26,54.61 57.15,54.61 J9.1 59.77,51.99 59.77,48.72 62.23,46.25 62.23,6.99 J7.1 | TANT1.+ 32.88,42.43 VCAP5.1 31.56,41.35 STM32F446VET1.VREF+ | STM32F446VET1.VDDA 31.06,41.85 | v27.94,21.59 28.71,21.59 31.6,18.7 31.6,14.02 30.38,12.8 | C11.1 25.31,37.43 v25.35,37.47 22.12,40.69 16.52,40.69 C53.1 15.51,40.08 U11.13
  Top 0.254: v27.56,43.43 27.7,43.43 M9.2 29.21,42.43 VCAP5.1 31.06,41.85 | TANT1.+ 33.02,41.3 32.56,40.84 STM32F446VET1.VDD2 | C11.1 26.19,35.46 STM32F446VET1.VDD3 | v38.23,21.59 39.13,20.68 C26.1 41.02,20.68 C10.1 41.56,20.72 STM32F446VET1.VDD5 | 30.48,10.54 29.72,10.54 v29.34,10.16 29.34,10.07 28.68,9.42 28.68,3.07 29.69,2.06 44.89,2.06 U$5.1 | 30.48,10.54 U$2.2 | v44.7,41.78 43.84,42.64 U$31.P$1 | 30.48,10.54 29.87,11.15 29.87,12.29 30.38,12.8 v30.43,12.85 | R1.1 18.26,20.4 | 18.26,20.4 22.8,20.4 26.15,23.75 | v35.71,39.93 36.58,40.79 C21.1 | IC1.14 9.6,26.67 v9.14,26.21 | v9.73,21.43 15.55,21.43 15.57,21.41 17.25,21.41 18.26,20.4 | STM32F446VET1.VDD6 45.8,36.48 | 45.8,36.48 C9.1 | v45.85,37.47 45.85,36.52 45.8,36.48 | STM32F446VET1.VDD4 25.42,24.48 C12.1 26.15,23.75 | 26.15,23.75 v26.67,23.75
  Bottom 0.203: 26.67,26.67 26.64,26.64 v24.89,26.64 | U$16.2 24.31,31.04 24.31,29.21 24.59,28.93 25.87,28.93 26.67,28.12 26.67,27.86 | v17.78,45.72 18.3,45.72 C52.1 26.58,44.36 26.61,44.39 | 18.67,36.27 18.16,36.27 v17.78,36.65 | 17.78,28.17 U1.3 16.75,27.75 | 38.1,38.96 37.97,38.96 | 33.4,39.37 33.4,39.34 33.02,38.96 | 32,39.37 32,39.22 31.75,38.96 | 30.61,39.37 30.61,38.99 30.48,38.86 30.38,38.96 29.21,38.96 | 27.94,39.37 27.53,38.96 | 35.71,39.37 35.56,39.22 35.56,38.96
  Bottom 0.254: 16.75,27.75 C4.1 C3.1 | C22.1 30.61,39.37 | 32,39.37 C23.1 | 33.4,39.37 C24.1 | 27.94,39.37 27.94,43.05 v27.56,43.43 26.61,44.39 | 38.2,29.77 38.2,21.61 v38.23,21.59 | 44.45,36.83 45.09,37.47 v45.85,37.47 | 37.97,38.96 41.4,42.39 C46.1 C47.1 44.23,41.78 v44.7,41.78 | C-FLASH.2 29.21,10.29 v29.34,10.16 | v30.43,12.85 30.43,13.54 30.07,13.9 30.07,15.05 30.55,15.52 35.08,15.52 35.31,15.28 U$4.PIN4 | v35.71,39.93 35.71,39.37 | v9.14,26.21 8.89,25.96 8.89,22.27 v9.73,21.43
  Bottom 0.66: 26.04,37.47 v25.35,37.47 19.86,37.47 18.67,36.27 18.67,28.68 18.16,28.17 17.78,28.17 | 26.04,37.47 26.67,36.83 26.67,27.86 26.67,26.67 v26.67,23.75 26.67,22.86 v27.94,21.59 30.02,21.59 38.2,29.77 44.45,36.02 44.45,36.83 42.32,38.96 38.1,38.96 | 37.97,38.96 35.56,38.96 33.02,38.96 31.75,38.96 29.21,38.96 27.53,38.96 26.04,37.47
BATT_VOLTAGE  (via drill 0.35)
  Top 0.203: v20.95,33.12 21.59,32.48 STM32F446VET1.PC5
  Bottom 0.203: R13.1 C13.1 25.25,31.29 24.18,32.36 22.73,32.36 22.25,32.84 21.23,32.84 v20.95,33.12
BUZZER  (via drill 0.35)
  Top 0.203: STM32F446VET1.PA15 58.38,24.98 v59.64,23.72
  Bottom 0.203: v59.64,23.72 59.64,25.13 R27.2
COM_BLUE  (via drill 0.35)
  Top 0.203: STM32F446VET1.PA0 30.56,39.03 29.5,40.08 28.12,40.08 21.14,47.06 14.79,47.06 13.49,45.76 12.46,45.76 v12.44,45.75 | v8.47,41.39 7.34,41.39 R108.2
  Bottom 0.203: v12.44,45.75 12.29,45.6 12.29,44.82 8.86,41.39 v8.47,41.39
COM_GREEN  (via drill 0.35)
  Top 0.203: STM32F446VET1.PA2 29.56,39.02 29.21,39.37 27.82,39.37 20.84,46.35 15.09,46.35 13.64,44.9 13.64,44.4 v13.36,44.12 | v9.32,38.63 8.05,37.36 R107.2
  Bottom 0.203: v13.36,44.12 12.6,44.12 9.32,40.84 v9.32,38.63
COM_RED  (via drill 0.35)
  Top 0.203: STM32F446VET1.PA1 30.06,39.02 29.36,39.73 27.97,39.73 20.99,46.71 17.78,46.71 17.73,46.71 14.94,46.71 13.26,45.03 v13.01,45.03 | v8.48,39.42 7.35,39.42 R106.2
  Bottom 0.203: v13.01,45.03 8.48,40.51 v8.48,39.42
CONTROL_SENSOR_A
  Top 0.203: STM32F446VET1.PE14 27.13,26.98 26.17,27.94 IC1.2
CONTROL_SENSOR_B
  Top 0.203: STM32F446VET1.PE13 27.13,27.48 26.31,28.3 18.69,28.3 17.78,29.21 IC1.3
CPU_AB_SDA  (via drill 0.35)
  Top 0.203: IC1.13 12.14,27.94 15.95,31.75 IC1.5 17.98,31.75 18.87,30.86 18.87,30.48 v19.6,29.76 | v22.58,13.19 27.45,13.19 28.27,12.37 28.27,2.94 29.54,1.68 46.02,1.68 46.58,1.12 50.32,1.12 50.8,1.6 v50.8,3.54 | v45.72,25.61 44.85,26.48 STM32F446VET1.PC12
  Bottom 0.203: v19.6,29.76 20.32,29.04 20.32,21.04 22.86,18.5 22.86,13.47 v22.58,13.19 | v50.8,3.54 48.52,3.54 45.72,6.34 v45.72,25.61
FLASH_CS
  Top 0.203: STM32F446VET1.PB12 29.56,21.59 29.56,21.24 32.51,18.29 R127.2
FLASH_MISO
  Top 0.203: STM32F446VET1.PB14 30.56,21.25 35.81,15.99 R124.2
FLASH_MOSI
  Top 0.203: R125.2 36.71,16.59 35.72,16.59 31.06,21.25 STM32F446VET1.PB15
FLASH_RESET
  Top 0.203: STM32F446VET1.PD8 31.56,21.25 35.87,16.95 36.86,16.95 37.21,16.59 38.36,16.59 R119.1
FLASH_SCK
  Top 0.203: R126.2 34.16,17.14 30.06,21.24 STM32F446VET1.PB13
GND  (via drill 0.35)  (249 unrouted)
  Top 0.203: S1.5 1.5,10.95 1.37,10.82 1.37,10.26 1.27,10.16 1.37,10.06 1.37,9.71 1.52,9.56 3.02,9.56 S1.2 | v39.65,36.63 37.36,36.63 37.06,36.93 STM32F446VET1.VSS1 | STM32F446VET1.VSSA 32.06,37.62 31.98,37.54 v31.98,36.96 | U11.20 v18.87,42.57 | U11.18 17.73,41.4 v18.92,41.4
  Bottom 0.203: R12.1 22.89,29.32 22.89,28.93 22.8,28.85 22.8,27.54 22.89,27.46 v22.89,26.98
  other vias: 24.13,45.72 26.67,45.72 29.21,45.72 31.75,45.72 21.59,42.55 24.56,40.06 19.02,39.27 21.62,39.29 19.08,48.18 19.08,51.99 21.62,51.99 25.43,51.99 20.85,45.19 15.77,36.3 14.5,36.3 10.69,38.84 10.69,40.97 8.92,33.02 8.92,34.29 8.92,31.75 7.65,33.02 7.65,35.56 7.65,34.29 8.92,35.56 6.38,34.29 5.11,30.48 6.38,30.48 6.38,29.21 5.11,31.75 2.57,20.32 3.84,21.59 2.57,22.86 7.65,17.78 8.92,20.32 5.11,12.7 5.11,11.43 7.65,3.81 7.65,11.43 10.19,3.81 13.89,3.73 16.74,3.68 19.68,3.71 24.13,8.69 22.86,8.69 25.4,6.15 22.86,7.42 26.54,3.61 29.57,4.6 27.05,8.66 33.96,11.25 34.01,8.86 33.96,5 37.54,5 37.49,8.81 36.83,11.4 31.75,12.67 41.91,5.05 43.89,10.06 47.57,14.71 50.7,14.83 52.76,8.61 59.64,15.85 59.64,19.66 59.69,22.15 55.83,23.47 55.83,20.93 43.13,22.2 43.13,18.39 38.23,19.35 35.69,19.35 37.08,24.54 35.81,29.62 39.62,33.43 40.89,34.7 41.81,30.61 41.88,29.21 29.11,28.07 30.38,33.15 30.38,30.61 30.38,35.69 50.77,29.84 50.7,26.34 55.91,28.27 55.35,30.1 57.53,39.37 61.09,35.56 61.04,37.87 60.93,40.79 61.09,43.69 59.49,46.81 57.1,41.88 53.37,43.03 53.44,46.94 51,46.84 50.83,44.35 48.67,37.36 48.31,34.47 34.37,41.17 34.29,43.13 34.32,45.24 36.83,45.69 39.34,45.75 39.34,44.48 41.88,45.75 48.23,52.1 50.77,49.56 43.15,54.64 43.15,49.56 34.26,54.64 31.72,50.83 8.89,51.99 4.72,51.79 3.78,41.94 3.78,44.48 10.13,47.02 10.13,45.75 12.67,30.51 25.35,34.85 22.38,34.98 22.02,22.83 19.05,22.86 19.02,25.32 10.13,15.16 13.94,15.16 13.94,18.97 29.18,18.97 29.18,17.7 25.37,15.16 19.68,26.67 25.83,38.79 22.1,25.27 36.68,33.66 46.81,23.85 48.54,17.81 48.54,19.08 51.08,17.81 51.08,19.08 43.13,20.93 41.91,36.14 3.38,36.37 13.39,31.57 15.72,24.77 18.9,19.63 11.46,15.21 29.24,16.48 33.88,12.88 43.1,23.52 59.69,27.84 57.15,26.57 61.32,26.8 41.12,24.03 13.11,39.65 15.47,28.5 10.19,10.16 12.85,11.07 15.88,11.13 18.82,11.07 14.4,27.38
  pour Top: -5.08,0 1.27,-6.35 68.58,-6.35 72.39,-2.54 72.39,59.69 68.58,63.5 67.31,64.77 1.27,64.77 -5.08,58.42
  pour Bottom: -5.08,58.42 -5.08,0 1.27,-6.35 68.58,-6.35 72.39,-2.54 72.39,59.69 67.31,64.77 1.27,64.77
IND_LED  (via drill 0.35)
  Top 0.203: STM32F446VET1.PE1 51.67,35.48 v51.82,35.33 | R7.1 49.87,21.93 49.87,23.02 v49.96,23.11
  Bottom 0.203: v51.82,35.33 52.09,35.05 52.09,25.25 v49.96,23.11
LOOP_LED  (via drill 0.35)
  Top 0.203: v48.34,23.85 47.24,22.76 R3.1 | STM32F446VET1.PE0 44.35,34.98 44.5,35.12 50.74,35.12 v51.38,34.49
  Bottom 0.203: v48.34,23.85 50.2,23.85 51.74,25.39 51.74,34.12 v51.38,34.49
MPU_CS
  Top 0.203: U11.22 22.3,43.38 27.91,37.77 27.91,37.5 28.66,36.75 28.66,35.21 28.43,34.98 STM32F446VET1.PA4
MPU_INT  (via drill 0.35)  (1 unrouted)
  Top 0.203: STM32F446VET1.PC4 26.79,32.98 26.14,33.63 21.7,33.63 16.69,38.63 v14.35,38.63 v14.35,38.64 | v14.41,41.33 14.17,41.56 14.17,41.78 14.57,42.18 14.76,42.18
  Bottom 0.203: v14.35,38.64 14.41,38.69 v14.41,41.33
MPU_MISO
  Top 0.203: U11.9 14.06,43.38 14.06,43.39 12.68,43.39 12.29,43 12.29,39.36 12.77,38.89 13.46,38.89 13.87,39.29 14.71,39.29 15.01,38.99 16.84,38.99 21.84,33.98 STM32F446VET1.PA6
MPU_MOSI
  Top 0.203: STM32F446VET1.PA7 28.43,33.48 29.38,34.43 29.38,37.05 28.63,37.8 28.63,38.06 22.6,44.09 18.72,44.09 18.63,44.18 U11.24
MPU_SCK
  Top 0.203: U11.23 18.45,43.78 18.49,43.74 22.45,43.74 28.27,37.92 28.27,37.65 29.02,36.9 29.02,35.06 28.44,34.48 STM32F446VET1.PA5
MS56_CS  (via drill 0.35)
  Top 0.203: v49.81,30.48 49.38,30.91 44.62,30.91 44.19,30.48 STM32F446VET1.PD7 | v50.8,41.91 48.26,41.91 47.59,42.58 U$31.P$4 U$31.P$5
  Bottom 0.203: v50.8,41.91 50.52,41.63 50.52,34.2 50.9,33.82 50.9,32.7 50.44,32.25 50.44,31.12 49.81,30.49 v49.81,30.48
MS56_MISO  (via drill 0.35)
  Top 0.203: STM32F446VET1.PB4 44.18,31.48 44.32,31.62 49.16,31.62 49.65,32.12 49.65,33.16 v49.56,33.26 | v49.18,45.81 48.07,46.91 46.74,46.91 46.34,46.52 U$31.P$6
  Bottom 0.203: v49.56,33.26 49.46,33.36 49.46,45.53 v49.18,45.81
MS56_MOSI  (via drill 0.35)
  Top 0.203: STM32F446VET1.PB5 48.62,31.98 v49.02,32.38 | v49.54,46.72 48.98,47.27 45.72,47.27 45.09,46.64 U$31.P$7
  Bottom 0.203: v49.54,46.72 49.81,46.44 49.81,33.9 50.19,33.52 50.19,33 49.82,32.63 49.27,32.63 v49.02,32.38
MS56_SCK  (via drill 0.35)
  Top 0.203: STM32F446VET1.PB3 44.18,30.98 44.47,31.27 49.69,31.27 v49.81,31.39 | v49.78,47.62 44.83,47.62 43.84,46.64 U$31.P$8
  Bottom 0.203: v49.78,47.62 50.17,47.24 50.17,34.05 50.55,33.67 50.55,32.85 49.81,32.12 v49.81,31.39
N$1
  Top 0.254: R1.2 3V3.A
N$2
  Top 0.203: LOOP.A R3.2
N$4
  Bottom 1.27: U$1.P$1 2.54,27 2.54,29.25 3.3,30.01 D1.A
N$5
  Top 0.254: R4.2 5V1.A
N$6  (via drill 0.35)
  Top 0.203: STM32F446VET1.PE8 26.94,29.98 26.65,29.69 20.81,29.69 18.16,32.33 15.88,32.33 12.14,28.6 7.47,28.6 v6.73,27.86 | v1.78,8.43 R5.1
  Bottom 0.203: v6.73,27.86 6.35,27.48 6.35,21.59 1.78,17.02 v1.78,8.43
N$7  (via drill 0.35)
  Top 0.203: STM32F446VET1.PE9 26.94,29.48 26.8,29.34 26.62,29.34 26.29,29.01 19.45,29.01 18.52,29.95 18.52,30.71 18.16,31.06 15.77,31.06 11.96,27.25 8.48,27.25 8.02,26.8 v7.04,26.8 | v3.81,8.43 R8.1
  Bottom 0.203: v7.04,26.8 6.71,26.47 6.71,21.44 2.13,16.87 2.13,10.11 v3.81,8.43
N$8
  Top 0.203: IND.A R7.2
N$9
  Bottom 0.203: R12.2 23.56,30.33 | 23.56,30.33 R11.1 25.03,28.19 R13.2 | U$16.3 22.2,32.38 22.76,31.83 22.76,30.91 23.34,30.33 23.56,30.33
N$10  (via drill 0.35)
  Top 0.203: v7.59,23.98 8.84,25.22 12.52,25.22 13.49,26.19 13.49,27.46 15.82,29.79 18.16,29.79 19.31,28.65 26.47,28.65 26.8,28.98 STM32F446VET1.PE10 | v5.87,8.43 5.87,7.22 R6.1
  Bottom 0.203: v7.59,23.98 7.57,23.98 7.06,23.47 7.06,21.3 2.49,16.72 2.49,11.81 v5.87,8.43
N$11
  Top 0.203: STM32F446VET1.BOOT0 43.92,33.48 44.53,34.09 R10.2
N$12  (via drill 0.35)
  Top 0.203: v36.49,34.95 36.49,35.77 36.06,36.2 STM32F446VET1.PH0
  Bottom 0.203: C31.1 37.09,36.82 Q1.3 36.76,35.22 v36.49,34.95
N$13  (via drill 0.35)
  Top 0.203: v35.56,35.31 STM32F446VET1.PH1
  Bottom 0.203: C32.1 33.91,31.64 Q1.1 35.56,33.29 v35.56,35.31
N$14
  Top 0.254: RED.A 2.54,4.74 R5.2
N$15
  Top 0.254: GREEN.A R8.2
N$16
  Top 0.254: R6.2 5.08,4.74 BLUE.A
N$17
  Top 0.254: R9.2 11.43,5.24 J5.1
N$18
  Bottom 0.254: R15.2 14.35,7.62 15.62,6.35 15.62,3.43 J5.7
N$19
  Top 0.254: R14.2 17.4,5.2 J5.3
N$20  (via drill 0.35)
  Top 0.254: v39.06,24.13 40.01,24.13 40.56,23.57 STM32F446VET1.VCAP2
  Bottom 0.254: VCAP.1 39.58,24.13 v39.06,24.13
N$24
  Bottom 0.203: R26.1 61.05,32.38 R25.1 60.24,34.46 58.74,34.46 58.42,34.14 58.42,33.33 T2.B
N$25
  Top 0.254: R16.2 J5.2
N$26  (via drill 3.1)  (2 unrouted)
  other vias: 7,15 7,45 48,28
N$27
  Top 0.254: R17.2 20.32,5.17 J5.4
N$29
  Bottom 0.254: R18.2 11.43,7.62 12.7,6.35 12.7,3.5 J5.6
N$31
  Bottom 0.203: T2.C 56.86,30.53 56.86,29.49 BUZ2.+
N$32
  Bottom 0.203: T1.C 59.98,29.84 R26.2
N$33
  Bottom 0.203: R27.1 60.45,26.1 60.45,29.18 61.3,30.03 T1.B
N$34
  Bottom 0.254: R19.2 17.4,7.49 18.54,6.35 18.54,3.35 J5.8
N$35
  Top 0.203: C51.1 13.71,42.98 U11.10
N$70  (via drill 0.35)
  Top 0.203: STM32F446VET1.VCAP_1 27.91,25.58 28.52,25.58 29.05,26.11 v29.05,26.75
  Bottom 0.203: VCAP4.1 29.55,24.93 29.05,25.43 v29.05,26.75
N$102
  Top 0.203: D2.2 4.73,38.5 R106.1
N$103
  Top 0.203: R107.1 3.73,37.36 3.38,37.72 3.38,38.49 D2.3
N$104
  Top 0.203: D2.4 3.66,40.52 3.66,40.73 4.33,41.4 R108.1
N$108  (via drill 0.35)
  Top 0.203: STM32F446VET1.PC14 38.06,40.36 v38.17,40.46
  Bottom 0.203: C54.1 39.1,41.94 VCAP6.1 38.97,41.27 v38.17,40.46
N$109  (via drill 0.35)
  Top 0.203: STM32F446VET1.PC15 37.56,39.71 v37.43,39.84
  Bottom 0.203: C69.2 35.83,41.81 VCAP6.2 37.43,41.35 v37.43,39.84
N$161
  Top 0.203: R126.1 34.41,14.14 35.16,14.89 40.48,14.89 41.27,14.1 41.27,12.32 40.77,11.81 U$2.16
N$162
  Top 0.203: R125.1 37.47,11.94 38.86,10.54 U$2.15
N$163
  Top 0.203: R124.1 35.56,13.88 35.56,5.08 33.4,2.92 U$2.8
N$164
  Top 0.203: U$2.7 32.38,4.19 32.51,4.32 R127.1
N$165  (via drill 0.35)
  Top 0.203: v29.34,9.14 29.46,9.27 U$2.3
  Top 0.254: R119.2 39.79,13.46 v40.39,13.46
  Bottom 0.254: v40.39,13.46 40.39,14.73 39.19,15.93 30.33,15.93 29.67,15.27 29.67,10.97 30.35,10.29 30.35,9.91 29.59,9.14 v29.34,9.14
N$166
  Bottom 0.203: R128.2 U$4.DETECT
NRST  (via drill 0.35)
  Top 0.203: U$5.5 46.74,8.64 49.53,11.43 52.45,11.43 52.46,11.44 52.5,11.44 52.83,11.78 v52.92,11.78 | v52.58,38.48 43,38.48 38.81,34.29 35.56,34.29 34.93,34.92 34.93,35.57 35.06,35.7 STM32F446VET1.NRST 35.06,46.22 33.78,47.5 13.41,47.5 v13.36,47.55 | v4.12,17.46 3.38,17.46 C14.1
  Top 0.254: C14.1 2.05,14.44 S1.4 S1.1
  Bottom 0.203: v52.58,38.48 52.45,38.35 52.45,12.25 v52.92,11.78 | v13.36,47.55 12.19,46.38 12.18,46.38 2.41,36.61 2.41,33.74 2.78,33.38 5.23,33.38 8.51,30.09 8.51,22.24 4.12,17.86 v4.12,17.46
SD_CARD_CS  (via drill 0.35)
  Top 0.203: STM32F446VET1.PE4 40.56,39.05 41.57,40.06 53.67,40.06 55.13,38.59 v55.13,37.97
  Bottom 0.203: U$4.PIN2 37.51,14.05 48.74,2.82 52.3,2.82 52.43,2.94 52.43,5.54 53.55,6.67 53.55,12.04 52.81,12.79 52.81,13.14 52.81,37.45 53.96,38.6 54.49,38.6 v55.12,37.97 v55.13,37.97
SD_CARD_DETECT  (via drill 0.35)
  Top 0.203: STM32F446VET1.PE3 41.06,39.04 41.72,39.7 53.52,39.7 54.23,39 v54.23,37.97 | v53.37,5.52 52.85,5 52.85,3.44 54.08,2.21 v54.08,2.15
  Bottom 0.203: v54.23,37.97 53.84,37.97 53.16,37.29 53.16,12.93 53.91,12.19 53.91,6.06 v53.37,5.52 | C-FLASH1.2 R128.1 25.81,12.69 25.81,10.94 25.81,10.93 25.81,9.64 25.81,8.38 26.85,7.34 42.21,7.34 48.16,1.39 53.32,1.39 v54.08,2.15
SD_CARD_MISO  (via drill 0.35)
  Top 0.203: STM32F446VET1.PE5 40.06,39.05 41.42,40.41 53.82,40.41 56.04,38.19 v56.04,37.97
  Bottom 0.203: v56.04,37.97 56.04,37.95 53.9,35.8 53.9,13.2 54.62,12.48 54.62,3.59 52.78,1.75 48.3,1.75 37.94,12.12 33.38,12.12 32.01,13.48 U$4.PIN7
SD_CARD_MOSI  (via drill 0.35)
  Top 0.203: STM32F446VET1.PE6 39.56,39.05 41.27,40.77 54.14,40.77 56.94,37.97 v56.95,37.97 | v53.48,4.61 53.79,4.61 54.69,3.71 v55.25,3.71
  Bottom 0.203: v56.95,37.97 56.95,37.95 54.25,35.25 54.25,13.35 54.98,12.63 54.98,5.33 55.28,5.03 55.28,3.73 v55.25,3.71 | U$4.PIN3 36.86,14.03 36.86,13.75 37.09,13.51 37.55,13.51 48.6,2.46 52.45,2.46 53.81,3.82 53.81,4.28 v53.48,4.61
SD_CARD_SCK  (via drill 0.35)
  Top 0.203: STM32F446VET1.PE2 41.56,39.04 41.86,39.34 52.61,39.34 53.59,38.36 53.59,37.71 53.8,37.51 v53.8,37.03
  Bottom 0.203: U$4.PIN5 34.21,13.74 34.8,13.16 37.4,13.16 48.45,2.1 52.63,2.1 53.2,2.68 53.55,3.02 54.27,3.74 54.27,12.33 53.54,13.06 53.54,36.78 v53.8,37.03
SENSOR_A_DRDY  (via drill 0.35)
  Top 0.203: STM32F446VET1.PD14 34.56,23.33 34.66,23.43 38.64,27.42 v38.9,27.42
  Bottom 0.203: v38.9,27.42 38.9,29.64 46.09,36.83 46.11,36.83 46.66,37.38 46.66,43.51 43.18,46.99 22.86,46.99 18.9,50.95 14.4,50.95 J8.5
SENSOR_A_SDA
  Top 0.203: J8.4 6.1,51.84 6.1,49.66 5.08,48.64 3.87,48.64 2.23,47 2.23,25.15 5.13,22.25 6.88,22.25 9.5,24.87 12.67,24.87 14.47,26.67 IC1.1
SENSOR_AB_SCL
  Top 0.203: J6.3 28.93,54.61 9.06,54.61 J8.3 7.69,53.42 6.55,54.56 4.04,54.56 3.4,53.92 3.4,48.67 1.88,47.15 1.88,25 4.99,21.89 7.03,21.89 9.65,24.51 12.82,24.51 14.29,25.98 STM32F446VET1.PB10
SENSOR_B_DRDY  (via drill 0.35)
  Top 0.203: STM32F446VET1.PD13 34.06,23.47 39.57,28.98 v39.72,28.98
  Bottom 0.203: v39.72,28.98 39.72,29.96 46.24,36.48 46.26,36.48 47.02,37.24 47.02,43.66 43.33,47.35 38.91,47.35 36.32,49.94 J6.5
SENSOR_B_SDA  (via drill 0.35)
  Top 0.203: v7.85,25.55 7.88,25.58 12.38,25.58 13.13,26.34 13.13,27.61 16.01,30.48 IC1.4
  Bottom 0.203: v7.85,25.55 7.85,30.25 5.08,33.02 2.54,33.02 1.83,33.73 1.83,44.68 5.41,48.26 10.22,48.26 11.76,49.8 11.76,49.85 13.97,52.07 15.24,52.07 16.51,53.34 27.2,53.34 J6.4
SENSOR_C_DRDY
  Top 0.203: STM32F446VET1.PD12 33.56,19.75 36.01,17.3 37.01,17.3 37.36,16.95 38.51,16.95 38.87,16.59 39.77,16.59 40.23,16.13 53.21,16.13 55.24,14.1 55.24,5.33 55.88,4.7 J7.5
SENSOR_C_SCL
  Top 0.203: STM32F446VET1.PA8 37.56,21.82 37.42,21.67 37.42,17.9 37.66,17.66 38.8,17.66 39.16,17.3 40.07,17.3 40.53,16.84 53.52,16.84 55.5,14.86 60.71,14.86 61.21,14.35 61.21,11.97 J7.3
SENSOR_C_SDA
  Top 0.203: STM32F446VET1.PC9 37.06,17.75 37.51,17.3 38.66,17.3 39.01,16.95 39.92,16.95 40.38,16.48 53.36,16.48 55.63,14.22 55.63,13 56.56,12.06 58.67,12.06 59.94,13.34 J7.4
SENSOR_D_DRDY  (via drill 0.35)
  Top 0.203: STM32F446VET1.PD11 33.06,25.48 v32.88,25.66 | v42.9,37.16 43.87,38.12 50.11,38.12 54.03,34.21 54.46,34.21 56.24,35.99 58.27,35.99 59.13,36.85 59.13,43.9 54.27,48.75 v53.86,48.75
  Bottom 0.203: v32.88,25.66 33.27,25.66 43.53,35.92 43.53,36.53 v42.9,37.16 | v53.86,48.75 56.83,48.75 J9.5
SENSOR_D_SCL
  Top 0.203: STM32F446VET1.PB6 47.88,32.48 49.57,34.17 50.19,34.17 50.85,33.5 51.79,33.5 54.81,33.5 56.59,35.28 58.57,35.28 59.84,36.55 59.84,44.19 53.98,50.06 53.98,51.05 52.42,52.6 J9.3
SENSOR_D_SDA
  Top 0.203: STM32F446VET1.PB7 47.84,32.98 49.38,34.52 50.45,34.52 51.12,33.85 51.64,33.85 51.64,33.86 54.61,33.86 56.39,35.64 58.42,35.64 59.48,36.7 59.48,44.05 53.62,49.91 53.62,50.9 52.24,52.28 50.48,52.28 J9.4
STLINK_RX  (via drill 0.35)
  Top 0.203: U$5.8 50.64,12.7 v45.08,12.7 | v45.09,29.86 44.97,29.98 STM32F446VET1.PD6
  Bottom 0.203: v45.08,12.7 44.63,13.15 44.63,28.49 45.08,28.95 v45.08,29.86 v45.09,29.86
STLINK_TX  (via drill 0.35)
  Top 0.203: U$5.7 46.21,11.35 v44.25,11.35 | v44.45,29.21 44.18,29.48 STM32F446VET1.PD5
  Bottom 0.203: v44.45,29.21 44.25,29.01 v44.25,11.35
SUPPLY  (via drill 0.35)
  Top 0.254: v15.42,27.37 15.5,27.28 18.39,27.28 18.67,27.56 20.85,27.56 v21.74,26.67
  Bottom 0.254: 12.55,28.09 14.7,28.09 v15.42,27.37 | v21.74,26.67 21.74,28.08 R11.2
  Bottom 1.27: U3.1 17.14,21.34 12.7,21.34 12.13,21.91 12.09,21.91 11.06,22.93 C16.1 C17.1 11.06,26.6 12.55,28.09 13.92,29.45 13.92,30.2 16.51,32.79 | D1.C 6.49,37.47 C1.1 C2.1 11.06,34.38 11.05,34.37 12.62,32.79 16.51,32.79 | U1.1 16.51,32.79
SWCLK  (via drill 0.35)
  Top 0.203: U$5.3 43.56,6.1 42.67,6.99 42.67,14.7 v41.88,15.5 | v42.04,24.51 42.07,24.48 STM32F446VET1.PA14
  Bottom 0.203: v41.88,15.5 41.88,24.35 v42.04,24.51
SWDIO  (via drill 0.35)
  Top 0.203: v40.89,21.59 40.61,21.88 40.3,21.88 40.06,22.12 STM32F446VET1.PA13 | v40.97,15.5 42.32,14.15 42.32,6.84 44.07,5.08 47.8,5.08 47.81,5.09 48,5.09 48.64,5.74 48.64,6.86 49.15,7.37 U$5.4
  Bottom 0.203: v40.97,15.5 40.97,15.82 41.52,16.38 41.52,20.96 v40.89,21.59
UVC_ADC_1  (via drill 0.35)
  Top 0.203: C20.1 11.68,13.24 11.68,13.3 11.83,13.45 14.44,13.45 16.15,15.16 19.07,15.16 27.61,23.7 28.14,23.7 32.44,28 32.44,35.28 v32.17,35.56 | STM32F446VET1.PA3 27.28,37.03 v27.28,37.46
  Top 0.254: R9.1 11.43,12.41 C20.1
  Bottom 0.203: v27.28,37.46 30.27,37.46 v32.17,35.56
UVC_ADC_2
  Top 0.203: STM32F446VET1.PC3 33.06,37.38 32.8,37.12 32.8,27.86 28.29,23.34 27.76,23.34 19.22,14.81 16.29,14.81 C28.1
  Top 0.254: R16.1 14.35,12.53 C28.1
UVC_ADC_3
  Top 0.203: C25.1 17.36,13.4 18.41,14.45 19.39,14.45 19.6,14.66 19.6,14.69 27.9,22.99 28.43,22.99 33.16,27.71 33.16,36.27 33.56,36.68 STM32F446VET1.PC2
  Top 0.254: R14.1 17.4,12.66 C25.1
UVC_ADC_4  (via drill 0.35)
  Top 0.203: STM32F446VET1.PC1 34.06,36.68 33.51,36.13 33.51,24.27 v33.71,24.06 | C29.1 20.41,14.99 26.29,20.87 26.78,20.87 v26.81,20.89
  Top 0.254: R17.1 20.32,12.61 C29.1
  Bottom 0.203: v33.71,24.06 33.32,24.06 30.15,20.89 v26.81,20.89
UVC_ADC_5  (via drill 0.35)
  Top 0.203: STM32F446VET1.PC0 34.46,38.13 34.46,36.58 33.87,35.98 33.87,25.89 v34.72,25.03
  Bottom 0.203: v34.72,25.03 34.72,24.18 33.77,23.23 32.99,23.23 30.3,20.54 27.35,20.54 23.93,17.12 23.93,11.76 22.25,10.08 12.36,10.08 R18.1
  Bottom 0.254: R18.1 11.43,12.41 C30.1
UVC_ADC_6  (via drill 0.35)
  Top 0.203: STM32F446VET1.PB1 27.17,31.48 27.02,31.62 19.83,31.62 v19.78,31.67
  Bottom 0.203: v19.78,31.67 20.75,30.71 20.75,24.23 20.75,21.11 23.22,18.65 23.22,12.93 22.66,12.37 19.56,12.37 18.47,13.45 14.94,13.45 C27.1
  Bottom 0.254: R15.1 14.35,12.53 C27.1
UVC_ADC_7  (via drill 0.35)
  Top 0.203: STM32F446VET1.PB0 20.75,31.98 v20.3,32.44
  Bottom 0.203: v20.3,32.44 21.1,31.63 21.1,27.54 21.11,27.54 21.11,21.26 23.57,18.8 23.57,11.91 22.1,10.44 17.97,10.44 R19.1
  Bottom 0.254: R19.1 17.4,12.66 C33.1
UVC_BOARD_SUPPLY  (via drill 0.35)
  Top 0.203: R4.1 18.67,17.86 20.07,19.25 v20.14,19.25 | v46.61,1.98 48.03,1.98 48.95,2.89 48.95,5.49 49.82,6.36 53.71,6.36 57.53,2.54 v58.42,2.54
  Top 0.406: v21.68,13 21.68,3.82 J5.10
  Bottom 0.203: R25.2 58.95,33.26 58.95,31.96 T2.E 58.27,30.37 58.27,28.48 58.42,28.33 v58.42,2.54 | J5.10 27.55,6.35 42.7,6.35 46.61,2.44 v46.61,1.98 | v20.14,19.25 20.78,19.25 21.45,18.58 C18.1
  Bottom 0.356: U3.3 17.53,16.38 20.05,16.38 C18.1 C19.1
  Bottom 0.406: C19.1 21.45,13.23 v21.68,13
VBAT
  Top 0.203: STM32F446VET1.VBAT 39.06,40.47 C48.1 40.91,40.91 41.13,41.12 54.17,41.12 U$32.+

### Text on the board
tPlace: Bartosz Z. | BeeLogic